# Altium project WAB_1x4.PrjPcb (part 1 of 2)
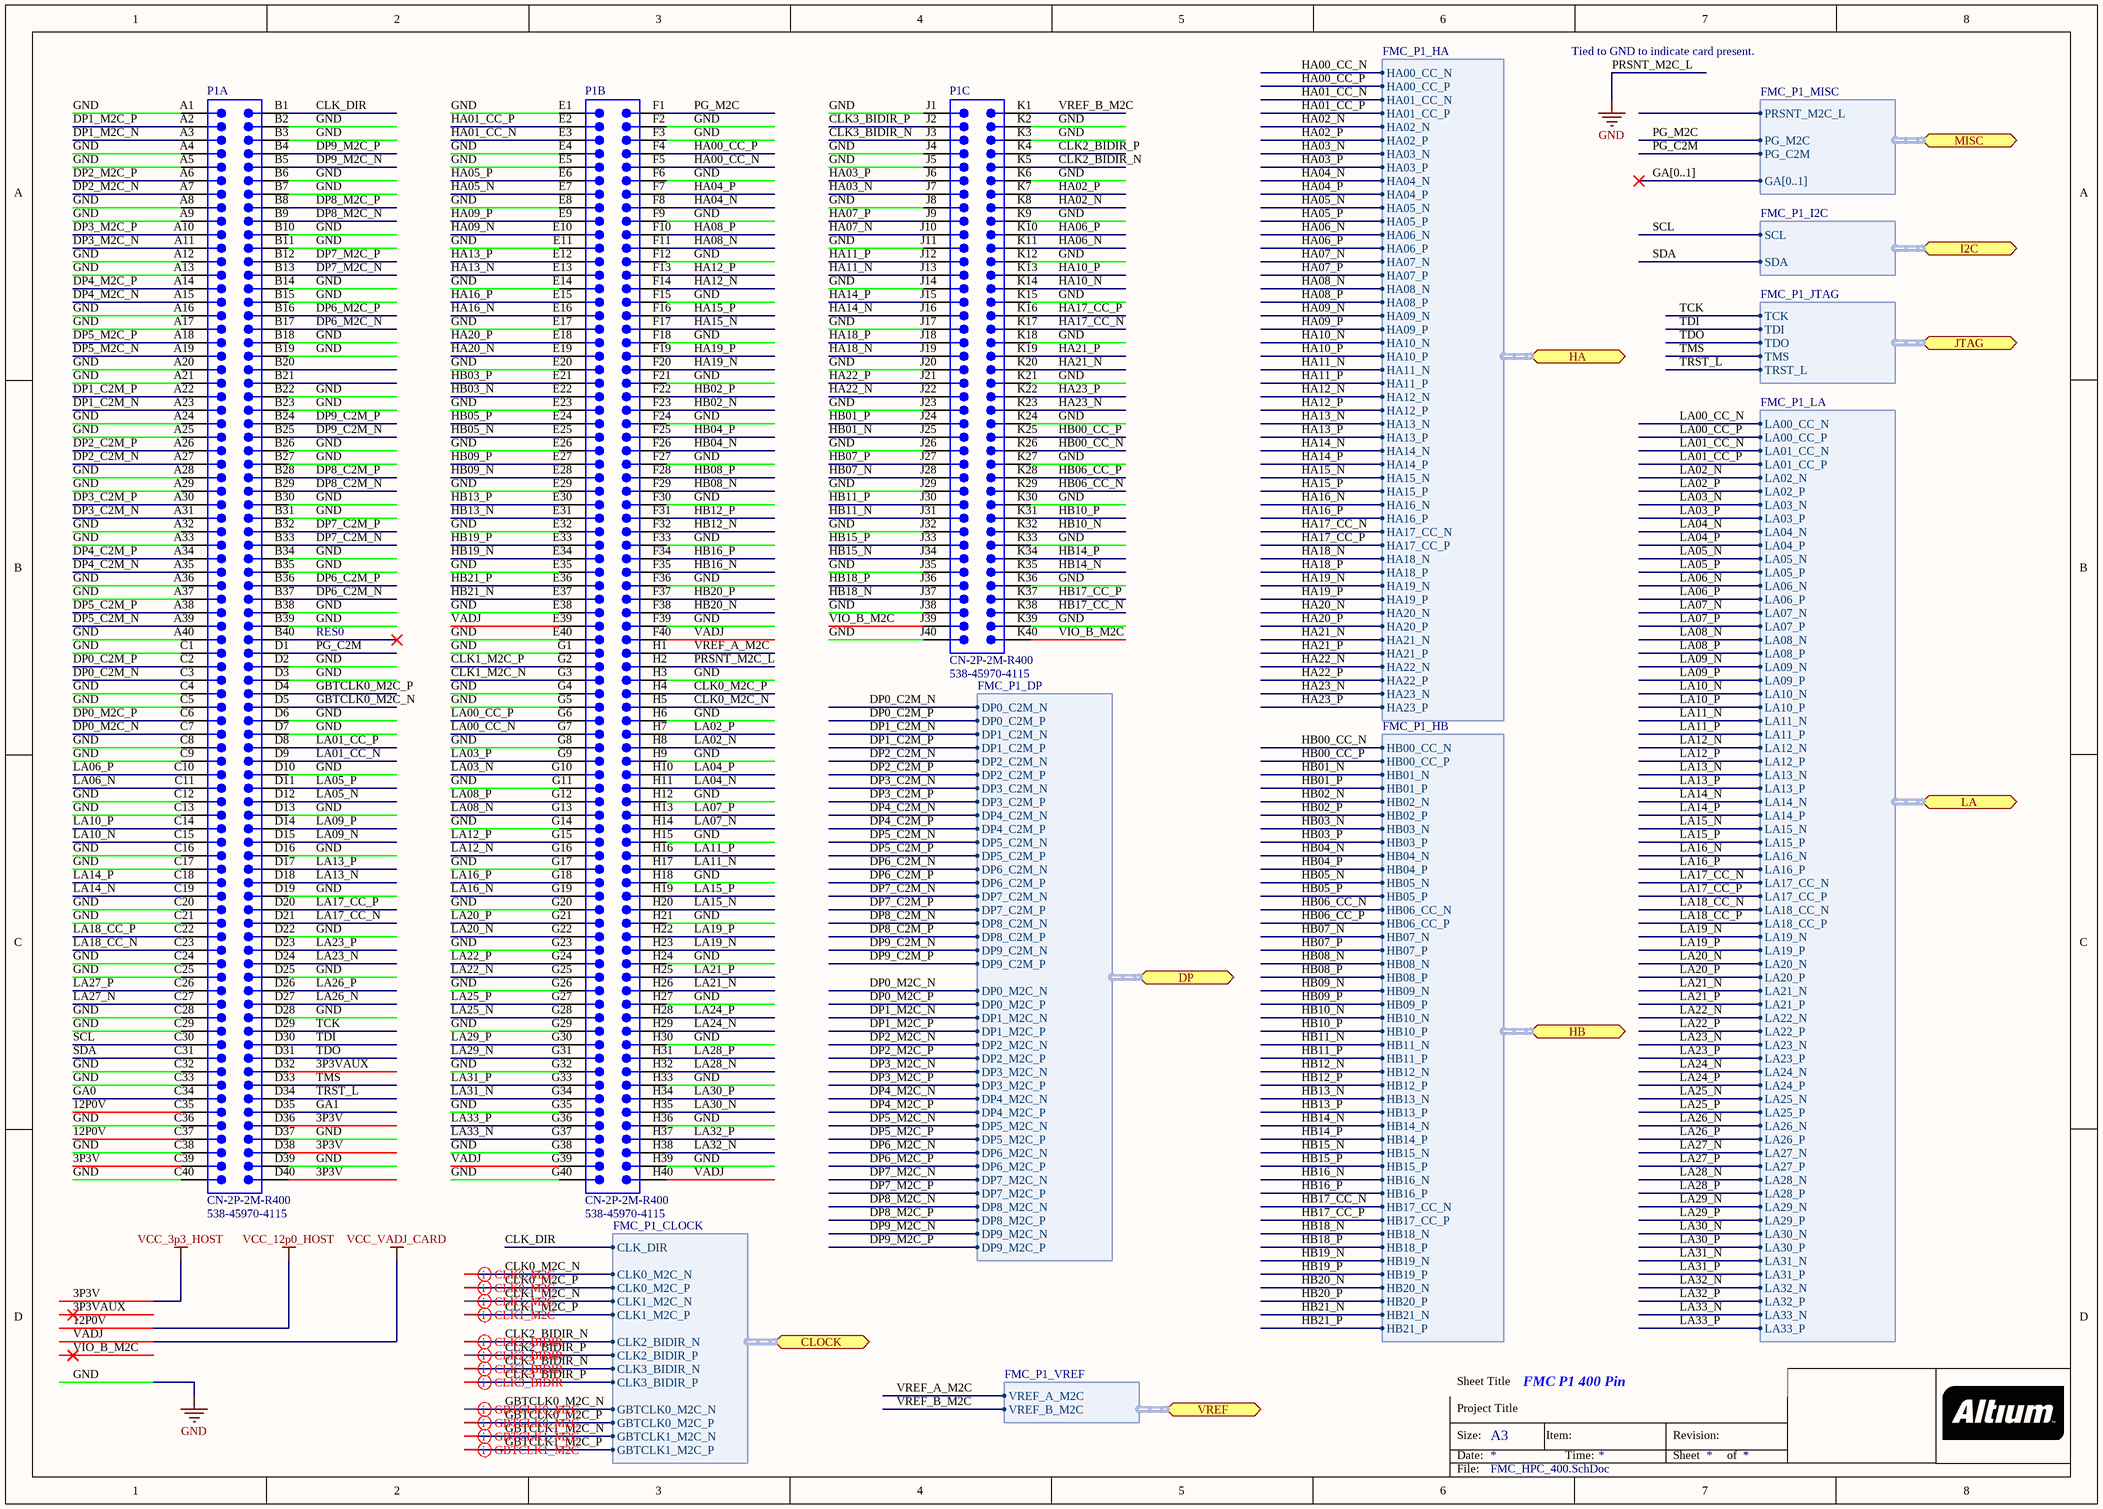
[diagram p0: FMC_HPC_400.SchDoc]
4 sheets, 113 parts. Net scope: flat (ports and power ports of the same name join across sheets).
Board file: WAB_1x4_PCB.PcbDoc
Sheets:
  FMC_HPC_400.SchDoc
  WAB_1x4_bus_transceivers.SchDoc
  WAB_1x4_HSMC_slots.SchDoc
  WAB_1x4_top.SchDoc

## Sheet FMC_HPC_400.SchDoc: FMC P1 400 Pin
size A3

### Parts
P1  CN-2P-2M-R400  Supplier Part Number 1: 538-45970-4115  [BTB-SM1-27-2V400M]  (parts A,B,C of 3)

### Ports
CLOCK (harness FMC_P1_CLOCK), DP (harness FMC_P1_DP), HA (harness FMC_P1_HA), HB (harness FMC_P1_HB), I2C (harness FMC_P1_I2C), JTAG (harness FMC_P1_JTAG), LA (harness FMC_P1_LA), MISC (harness FMC_P1_MISC), VREF (harness FMC_P1_VREF)

### Harnesses
FMC_P1_LA: LA05_N, LA05_P, LA06_N, LA06_P, LA09_N, LA09_P, LA10_N, LA10_P, LA13_N, LA13_P, LA14_N, LA14_P, LA23_N, LA23_P, LA26_N, LA26_P, LA27_N, LA27_P, LA02_N, LA02_P, LA03_N, LA03_P, LA04_N, LA04_P, LA07_N, LA07_P, LA08_N, LA08_P, LA11_N, LA11_P, LA12_N, LA12_P, LA15_N, LA15_P, LA16_N, LA16_P, LA19_N, LA19_P, LA20_N, LA20_P, LA21_N, LA21_P, LA22_N, LA22_P, LA24_N, LA24_P, LA25_N, LA25_P, LA28_N, LA28_P, LA29_N, LA29_P, LA30_N, LA30_P, LA31_N, LA31_P, LA32_N, LA32_P, LA33_N, LA33_P, LA00_CC_N, LA00_CC_P, LA01_CC_N, LA01_CC_P, LA17_CC_N, LA17_CC_P, LA18_CC_N, LA18_CC_P
FMC_P1_MISC: PRSNT_M2C_L, PG_M2C, PG_C2M, GA[0..1]
FMC_P1_JTAG: TCK, TDI, TDO, TMS, TRST_L
FMC_P1_I2C: SCL, SDA
FMC_P1_CLOCK: CLK2_BIDIR_N, CLK2_BIDIR_P, CLK3_BIDIR_N, CLK3_BIDIR_P, CLK0_M2C_N, CLK0_M2C_P, CLK1_M2C_N, CLK1_M2C_P, CLK_DIR, GBTCLK0_M2C_N, GBTCLK0_M2C_P, GBTCLK1_M2C_N, GBTCLK1_M2C_P
FMC_P1_VREF: VREF_A_M2C, VREF_B_M2C
FMC_P1_HB: HB02_N, HB02_P, HB03_N, HB03_P, HB04_N, HB04_P, HB05_N, HB05_P, HB08_N, HB08_P, HB09_N, HB09_P, HB12_N, HB12_P, HB13_N, HB13_P, HB16_N, HB16_P, HB19_N, HB19_P, HB20_N, HB20_P, HB21_N, HB21_P, HB01_N, HB01_P, HB07_N, HB07_P, HB10_N, HB10_P, HB11_N, HB11_P, HB14_N, HB14_P, HB15_N, HB15_P, HB18_N, HB18_P, HB17_CC_N, HB17_CC_P, HB06_CC_N, HB06_CC_P, HB00_CC_N, HB00_CC_P
FMC_P1_DP: DP1_C2M_N, DP1_C2M_P, DP1_M2C_N, DP1_M2C_P, DP2_C2M_N, DP2_C2M_P, DP2_M2C_N, DP2_M2C_P, DP3_C2M_N, DP3_C2M_P, DP3_M2C_N, DP3_M2C_P, DP4_C2M_N, DP4_C2M_P, DP4_M2C_N, DP4_M2C_P, DP5_C2M_N, DP5_C2M_P, DP5_M2C_N, DP5_M2C_P, DP6_C2M_N, DP6_C2M_P, DP6_M2C_N, DP6_M2C_P, DP7_C2M_N, DP7_C2M_P, DP7_M2C_N, DP7_M2C_P, DP8_C2M_N, DP8_C2M_P, DP8_M2C_N, DP8_M2C_P, DP9_C2M_N, DP9_C2M_P, DP9_M2C_N, DP9_M2C_P, DP0_C2M_N, DP0_C2M_P, DP0_M2C_N, DP0_M2C_P
FMC_P1_HA: HA04_N, HA04_P, HA05_N, HA05_P, HA08_N, HA08_P, HA09_N, HA09_P, HA12_N, HA12_P, HA13_N, HA13_P, HA15_N, HA15_P, HA16_N, HA16_P, HA19_N, HA19_P, HA20_N, HA20_P, HA02_N, HA02_P, HA03_N, HA03_P, HA06_N, HA06_P, HA07_N, HA07_P, HA10_N, HA10_P, HA11_N, HA11_P, HA14_N, HA14_P, HA18_N, HA18_P, HA21_N, HA21_P, HA22_N, HA22_P, HA23_N, HA23_P, HA17_CC_N, HA17_CC_P, HA00_CC_N, HA00_CC_P, HA01_CC_N, HA01_CC_P

### Nets
3P3V: P1.C39 P1.D36 P1.D38 P1.D40  [also labelled VCC_3p3_HOST]
12P0V: P1.C35 P1.C37  [also labelled VCC_12p0_HOST]
GND: P1.A1 P1.A4 P1.A5 P1.A8 P1.A9 P1.A12 P1.A13 P1.A16 P1.A17 P1.A20 P1.A21 P1.A24 P1.A25 P1.A28 P1.A29 P1.A32 P1.A33 P1.A36 P1.A37 P1.A40 P1.B2 P1.B3 P1.B6 P1.B7 P1.B10 P1.B11 P1.B14 P1.B15 P1.B18 P1.B19 P1.B22 P1.B23 P1.B26 P1.B27 P1.B30 P1.B31 P1.B34 P1.B35 P1.B38 P1.B39 P1.C1 P1.C4 P1.C5 P1.C8 P1.C9 P1.C12 P1.C13 P1.C16 P1.C17 P1.C20 P1.C21 P1.C24 P1.C25 P1.C28 P1.C29 P1.C32 P1.C33 P1.C36 P1.C38 P1.C40 P1.D2 P1.D3 P1.D6 P1.D7 P1.D10 P1.D13 P1.D16 P1.D19 P1.D22 P1.D25 P1.D28 P1.D37 P1.D39 P1.E1 P1.E4 P1.E5 P1.E8 P1.E11 P1.E14 P1.E17 P1.E20 P1.E23 P1.E26 P1.E29 P1.E32 P1.E35 P1.E38 P1.E40 P1.F2 P1.F3 P1.F6 P1.F9 P1.F12 P1.F15 P1.F18 P1.F21 P1.F24 P1.F27 P1.F30 P1.F33 P1.F36 P1.F39 P1.G1 P1.G4 P1.G5 P1.G8 P1.G11 P1.G14 P1.G17 P1.G20 P1.G23 P1.G26 P1.G29 P1.G32 P1.G35 P1.G38 P1.G40 P1.H2 P1.H3 P1.H6 P1.H9 P1.H12 P1.H15 P1.H18 P1.H21 P1.H24 P1.H27 P1.H30 P1.H33 P1.H36 P1.H39 P1.J1 P1.J4 P1.J5 P1.J8 P1.J11 P1.J14 P1.J17 P1.J20 P1.J23 P1.J26 P1.J29 P1.J32 P1.J35 P1.J38 P1.J40 P1.K2 P1.K3 P1.K6 P1.K9 P1.K12 P1.K15 P1.K18 P1.K21 P1.K24 P1.K27 P1.K30 P1.K33 P1.K36 P1.K39  [also labelled PRSNT_M2C_L]
VADJ: P1.E39 P1.F40 P1.G39 P1.H40  [also labelled VCC_VADJ_CARD]
3P3VAUX: P1.D32
CLK0_M2C_N: P1.H5 ; port CLOCK.CLK0_M2C_N
CLK0_M2C_P: P1.H4 ; port CLOCK.CLK0_M2C_P
CLK1_M2C_N: P1.G3 ; port CLOCK.CLK1_M2C_N
CLK1_M2C_P: P1.G2 ; port CLOCK.CLK1_M2C_P
CLK2_BIDIR_N: P1.K5 ; port CLOCK.CLK2_BIDIR_N
CLK2_BIDIR_P: P1.K4 ; port CLOCK.CLK2_BIDIR_P
CLK3_BIDIR_N: P1.J3 ; port CLOCK.CLK3_BIDIR_N
CLK3_BIDIR_P: P1.J2 ; port CLOCK.CLK3_BIDIR_P
CLK_DIR: P1.B1 ; port CLOCK.CLK_DIR
DP0_C2M_N: P1.C3 ; port DP.DP0_C2M_N
DP0_C2M_P: P1.C2 ; port DP.DP0_C2M_P
DP0_M2C_N: P1.C7 ; port DP.DP0_M2C_N
DP0_M2C_P: P1.C6 ; port DP.DP0_M2C_P
DP1_C2M_N: P1.A23 ; port DP.DP1_C2M_N
DP1_C2M_P: P1.A22 ; port DP.DP1_C2M_P
DP1_M2C_N: P1.A3 ; port DP.DP1_M2C_N
DP1_M2C_P: P1.A2 ; port DP.DP1_M2C_P
DP2_C2M_N: P1.A27 ; port DP.DP2_C2M_N
DP2_C2M_P: P1.A26 ; port DP.DP2_C2M_P
DP2_M2C_N: P1.A7 ; port DP.DP2_M2C_N
DP2_M2C_P: P1.A6 ; port DP.DP2_M2C_P
DP3_C2M_N: P1.A31 ; port DP.DP3_C2M_N
DP3_C2M_P: P1.A30 ; port DP.DP3_C2M_P
DP3_M2C_N: P1.A11 ; port DP.DP3_M2C_N
DP3_M2C_P: P1.A10 ; port DP.DP3_M2C_P
DP4_C2M_N: P1.A35 ; port DP.DP4_C2M_N
DP4_C2M_P: P1.A34 ; port DP.DP4_C2M_P
DP4_M2C_N: P1.A15 ; port DP.DP4_M2C_N
DP4_M2C_P: P1.A14 ; port DP.DP4_M2C_P
DP5_C2M_N: P1.A39 ; port DP.DP5_C2M_N
DP5_C2M_P: P1.A38 ; port DP.DP5_C2M_P
DP5_M2C_N: P1.A19 ; port DP.DP5_M2C_N
DP5_M2C_P: P1.A18 ; port DP.DP5_M2C_P
DP6_C2M_N: P1.B37 ; port DP.DP6_C2M_N
DP6_C2M_P: P1.B36 ; port DP.DP6_C2M_P
DP6_M2C_N: P1.B17 ; port DP.DP6_M2C_N
DP6_M2C_P: P1.B16 ; port DP.DP6_M2C_P
DP7_C2M_N: P1.B33 ; port DP.DP7_C2M_N
DP7_C2M_P: P1.B32 ; port DP.DP7_C2M_P
DP7_M2C_N: P1.B13 ; port DP.DP7_M2C_N
DP7_M2C_P: P1.B12 ; port DP.DP7_M2C_P
DP8_C2M_N: P1.B29 ; port DP.DP8_C2M_N
DP8_C2M_P: P1.B28 ; port DP.DP8_C2M_P
DP8_M2C_N: P1.B9 ; port DP.DP8_M2C_N
DP8_M2C_P: P1.B8 ; port DP.DP8_M2C_P
DP9_C2M_N: P1.B25 ; port DP.DP9_C2M_N
DP9_C2M_P: P1.B24 ; port DP.DP9_C2M_P
DP9_M2C_N: P1.B5 ; port DP.DP9_M2C_N
DP9_M2C_P: P1.B4 ; port DP.DP9_M2C_P
GA0: P1.C34
GA1: P1.D35
GBTCLK0_M2C_N: P1.D5 ; port CLOCK.GBTCLK0_M2C_N
GBTCLK0_M2C_P: P1.D4 ; port CLOCK.GBTCLK0_M2C_P
GBTCLK1_M2C_N: port CLOCK.GBTCLK1_M2C_N
GBTCLK1_M2C_P: port CLOCK.GBTCLK1_M2C_P
HA00_CC_N: P1.F5 ; port HA.HA00_CC_N
HA00_CC_P: P1.F4 ; port HA.HA00_CC_P
HA01_CC_N: P1.E3 ; port HA.HA01_CC_N
HA01_CC_P: P1.E2 ; port HA.HA01_CC_P
HA02_N: P1.K8 ; port HA.HA02_N
HA02_P: P1.K7 ; port HA.HA02_P
HA03_N: P1.J7 ; port HA.HA03_N
HA03_P: P1.J6 ; port HA.HA03_P
HA04_N: P1.F8 ; port HA.HA04_N
HA04_P: P1.F7 ; port HA.HA04_P
HA05_N: P1.E7 ; port HA.HA05_N
HA05_P: P1.E6 ; port HA.HA05_P
HA06_N: P1.K11 ; port HA.HA06_N
HA06_P: P1.K10 ; port HA.HA06_P
HA07_N: P1.J10 ; port HA.HA07_N
HA07_P: P1.J9 ; port HA.HA07_P
HA08_N: P1.F11 ; port HA.HA08_N
HA08_P: P1.F10 ; port HA.HA08_P
HA09_N: P1.E10 ; port HA.HA09_N
HA09_P: P1.E9 ; port HA.HA09_P
HA10_N: P1.K14 ; port HA.HA10_N
HA10_P: P1.K13 ; port HA.HA10_P
HA11_N: P1.J13 ; port HA.HA11_N
HA11_P: P1.J12 ; port HA.HA11_P
HA12_N: P1.F14 ; port HA.HA12_N
HA12_P: P1.F13 ; port HA.HA12_P
HA13_N: P1.E13 ; port HA.HA13_N
HA13_P: P1.E12 ; port HA.HA13_P
HA14_N: P1.J16 ; port HA.HA14_N
HA14_P: P1.J15 ; port HA.HA14_P
HA15_N: P1.F17 ; port HA.HA15_N
HA15_P: P1.F16 ; port HA.HA15_P
HA16_N: P1.E16 ; port HA.HA16_N
HA16_P: P1.E15 ; port HA.HA16_P
HA17_CC_N: P1.K17 ; port HA.HA17_CC_N
HA17_CC_P: P1.K16 ; port HA.HA17_CC_P
HA18_N: P1.J19 ; port HA.HA18_N
HA18_P: P1.J18 ; port HA.HA18_P
HA19_N: P1.F20 ; port HA.HA19_N
HA19_P: P1.F19 ; port HA.HA19_P
HA20_N: P1.E19 ; port HA.HA20_N
HA20_P: P1.E18 ; port HA.HA20_P
HA21_N: P1.K20 ; port HA.HA21_N
HA21_P: P1.K19 ; port HA.HA21_P
HA22_N: P1.J22 ; port HA.HA22_N
HA22_P: P1.J21 ; port HA.HA22_P
HA23_N: P1.K23 ; port HA.HA23_N
HA23_P: P1.K22 ; port HA.HA23_P
HB00_CC_N: P1.K26 ; port HB.HB00_CC_N
HB00_CC_P: P1.K25 ; port HB.HB00_CC_P
HB01_N: P1.J25 ; port HB.HB01_N
HB01_P: P1.J24 ; port HB.HB01_P
HB02_N: P1.F23 ; port HB.HB02_N
HB02_P: P1.F22 ; port HB.HB02_P
HB03_N: P1.E22 ; port HB.HB03_N
HB03_P: P1.E21 ; port HB.HB03_P
HB04_N: P1.F26 ; port HB.HB04_N
HB04_P: P1.F25 ; port HB.HB04_P
HB05_N: P1.E25 ; port HB.HB05_N
HB05_P: P1.E24 ; port HB.HB05_P
HB06_CC_N: P1.K29 ; port HB.HB06_CC_N
HB06_CC_P: P1.K28 ; port HB.HB06_CC_P
HB07_N: P1.J28 ; port HB.HB07_N
HB07_P: P1.J27 ; port HB.HB07_P
HB08_N: P1.F29 ; port HB.HB08_N
HB08_P: P1.F28 ; port HB.HB08_P
HB09_N: P1.E28 ; port HB.HB09_N
HB09_P: P1.E27 ; port HB.HB09_P
HB10_N: P1.K32 ; port HB.HB10_N
HB10_P: P1.K31 ; port HB.HB10_P
HB11_N: P1.J31 ; port HB.HB11_N
HB11_P: P1.J30 ; port HB.HB11_P
HB12_N: P1.F32 ; port HB.HB12_N
HB12_P: P1.F31 ; port HB.HB12_P
HB13_N: P1.E31 ; port HB.HB13_N
HB13_P: P1.E30 ; port HB.HB13_P
HB14_N: P1.K35 ; port HB.HB14_N
HB14_P: P1.K34 ; port HB.HB14_P
HB15_N: P1.J34 ; port HB.HB15_N
HB15_P: P1.J33 ; port HB.HB15_P
HB16_N: P1.F35 ; port HB.HB16_N
HB16_P: P1.F34 ; port HB.HB16_P
HB17_CC_N: P1.K38 ; port HB.HB17_CC_N
HB17_CC_P: P1.K37 ; port HB.HB17_CC_P
HB18_N: P1.J37 ; port HB.HB18_N
HB18_P: P1.J36 ; port HB.HB18_P
HB19_N: P1.E34 ; port HB.HB19_N
HB19_P: P1.E33 ; port HB.HB19_P
HB20_N: P1.F38 ; port HB.HB20_N
HB20_P: P1.F37 ; port HB.HB20_P
HB21_N: P1.E37 ; port HB.HB21_N
HB21_P: P1.E36 ; port HB.HB21_P
LA00_CC_N: P1.G7 ; port LA.LA00_CC_N
LA00_CC_P: P1.G6 ; port LA.LA00_CC_P
LA01_CC_N: P1.D9 ; port LA.LA01_CC_N
LA01_CC_P: P1.D8 ; port LA.LA01_CC_P
LA02_N: P1.H8 ; port LA.LA02_N
LA02_P: P1.H7 ; port LA.LA02_P
LA03_N: P1.G10 ; port LA.LA03_N
LA03_P: P1.G9 ; port LA.LA03_P
LA04_N: P1.H11 ; port LA.LA04_N
LA04_P: P1.H10 ; port LA.LA04_P
LA05_N: P1.D12 ; port LA.LA05_N
LA05_P: P1.D11 ; port LA.LA05_P
LA06_N: P1.C11 ; port LA.LA06_N
LA06_P: P1.C10 ; port LA.LA06_P
LA07_N: P1.H14 ; port LA.LA07_N
LA07_P: P1.H13 ; port LA.LA07_P
LA08_N: P1.G13 ; port LA.LA08_N
LA08_P: P1.G12 ; port LA.LA08_P
LA09_N: P1.D15 ; port LA.LA09_N
LA09_P: P1.D14 ; port LA.LA09_P
LA10_N: P1.C15 ; port LA.LA10_N
LA10_P: P1.C14 ; port LA.LA10_P
LA11_N: P1.H17 ; port LA.LA11_N
LA11_P: P1.H16 ; port LA.LA11_P
LA12_N: P1.G16 ; port LA.LA12_N
LA12_P: P1.G15 ; port LA.LA12_P
LA13_N: P1.D18 ; port LA.LA13_N
LA13_P: P1.D17 ; port LA.LA13_P
LA14_N: P1.C19 ; port LA.LA14_N
LA14_P: P1.C18 ; port LA.LA14_P
LA15_N: P1.H20 ; port LA.LA15_N
LA15_P: P1.H19 ; port LA.LA15_P
LA16_N: P1.G19 ; port LA.LA16_N
LA16_P: P1.G18 ; port LA.LA16_P
LA17_CC_N: P1.D21 ; port LA.LA17_CC_N
LA17_CC_P: P1.D20 ; port LA.LA17_CC_P
LA18_CC_N: P1.C23 ; port LA.LA18_CC_N
LA18_CC_P: P1.C22 ; port LA.LA18_CC_P
LA19_N: P1.H23 ; port LA.LA19_N
LA19_P: P1.H22 ; port LA.LA19_P
LA20_N: P1.G22 ; port LA.LA20_N
LA20_P: P1.G21 ; port LA.LA20_P
LA21_N: P1.H26 ; port LA.LA21_N
LA21_P: P1.H25 ; port LA.LA21_P
LA22_N: P1.G25 ; port LA.LA22_N
LA22_P: P1.G24 ; port LA.LA22_P
LA23_N: P1.D24 ; port LA.LA23_N
LA23_P: P1.D23 ; port LA.LA23_P
LA24_N: P1.H29 ; port LA.LA24_N
LA24_P: P1.H28 ; port LA.LA24_P
LA25_N: P1.G28 ; port LA.LA25_N
LA25_P: P1.G27 ; port LA.LA25_P
LA26_N: P1.D27 ; port LA.LA26_N
LA26_P: P1.D26 ; port LA.LA26_P
LA27_N: P1.C27 ; port LA.LA27_N
LA27_P: P1.C26 ; port LA.LA27_P
LA28_N: P1.H32 ; port LA.LA28_N
LA28_P: P1.H31 ; port LA.LA28_P
LA29_N: P1.G31 ; port LA.LA29_N
LA29_P: P1.G30 ; port LA.LA29_P
LA30_N: P1.H35 ; port LA.LA30_N
LA30_P: P1.H34 ; port LA.LA30_P
LA31_N: P1.G34 ; port LA.LA31_N
LA31_P: P1.G33 ; port LA.LA31_P
LA32_N: P1.H38 ; port LA.LA32_N
LA32_P: P1.H37 ; port LA.LA32_P
LA33_N: P1.G37 ; port LA.LA33_N
LA33_P: P1.G36 ; port LA.LA33_P
PG_C2M: P1.D1 ; port MISC.PG_C2M
PG_M2C: P1.F1 ; port MISC.PG_M2C
SCL: P1.C30 ; port I2C.SCL
SDA: P1.C31 ; port I2C.SDA
TCK: P1.D29 ; port JTAG.TCK  [project net JTAG_TCK]
TDI: P1.D30 ; port JTAG.TDI  [project net JTAG_TDI]
TDO: P1.D31 ; port JTAG.TDO  [project net JTAG_TDO]
TMS: P1.D33 ; port JTAG.TMS  [project net JTAG_TMS]
TRST_L: P1.D34 ; port JTAG.TRST_L  [project net ~{uC_RESET}]
VIO_B_M2C: P1.J39 P1.K40
VREF_A_M2C: P1.H1 ; port VREF.VREF_A_M2C
VREF_B_M2C: P1.K1 ; port VREF.VREF_B_M2C

Not connected (* = marked no-connect by the designer): P1 B20 B21 B40*

### Buses and harness runs
bus GA[0..1]

### Layout directives
differential pair: CLK0_M2C_N, CLK0_M2C_P, CLK1_M2C_N, CLK1_M2C_P, CLK2_BIDIR_N, CLK2_BIDIR_P, CLK3_BIDIR_N, CLK3_BIDIR_P, GBTCLK0_M2C_N, GBTCLK0_M2C_P, GBTCLK1_M2C_N, GBTCLK1_M2C_P

### Notes on the sheet
- Tied to GND to indicate card present.
- RES0
- Sheet Title
- Project Title
- Size:
- Date:
- A3
- Item:
- Time:
- Revision:
- Sheet
- of
- File:

### Library data of the parts
P1 = CN-2P-2M-R400: Board-to-Board Connector, Vertical, 10-Row, Pitch 1.27mm, 400-Position; Manufacturer: Molex; Manufacturer Part Number: 45970-4115; Current Rating: 2.7 A; Voltage Rating: 240 V; Number of Positions / Contacts: 400; Supplier 1: Mouser; RoHS: RoHS Compliant; Category: Board to Board & Mezzanine Connectors; Stock 1: 161; Pricing 1: 1=36.56, 10=32.14, 100=28.08, 300=26.87 (USD); Contact Plating: Gold; Housing Material: Thermoplastic; Mounting Angle: Vertical; Number of Rows: 10; Packaging: Reel; Series: 45970; Termination Style: SMD; Brand: Molex; Contact Material: Copper Alloy; Pitch: 1.27 mm; Product Category: Mezzanine Connectors; Product Type: Plugs; Standard Pack Qty: 300; Tradename: SEARAY; RoHS - Mouser: Y; Minimum Order Quantity: 1; Reeling: True; ComponentLink1URL: http://www.mouser.com/ds/2/276/0459704115_PCB_HEADERS-169229.pdf; ComponentLink1Description: http://www.mouser.com/ds/2/276/0459704115_PCB_HEADERS-169229.pdf

## Sheet WAB_1x4_bus_transceivers.SchDoc
size A2
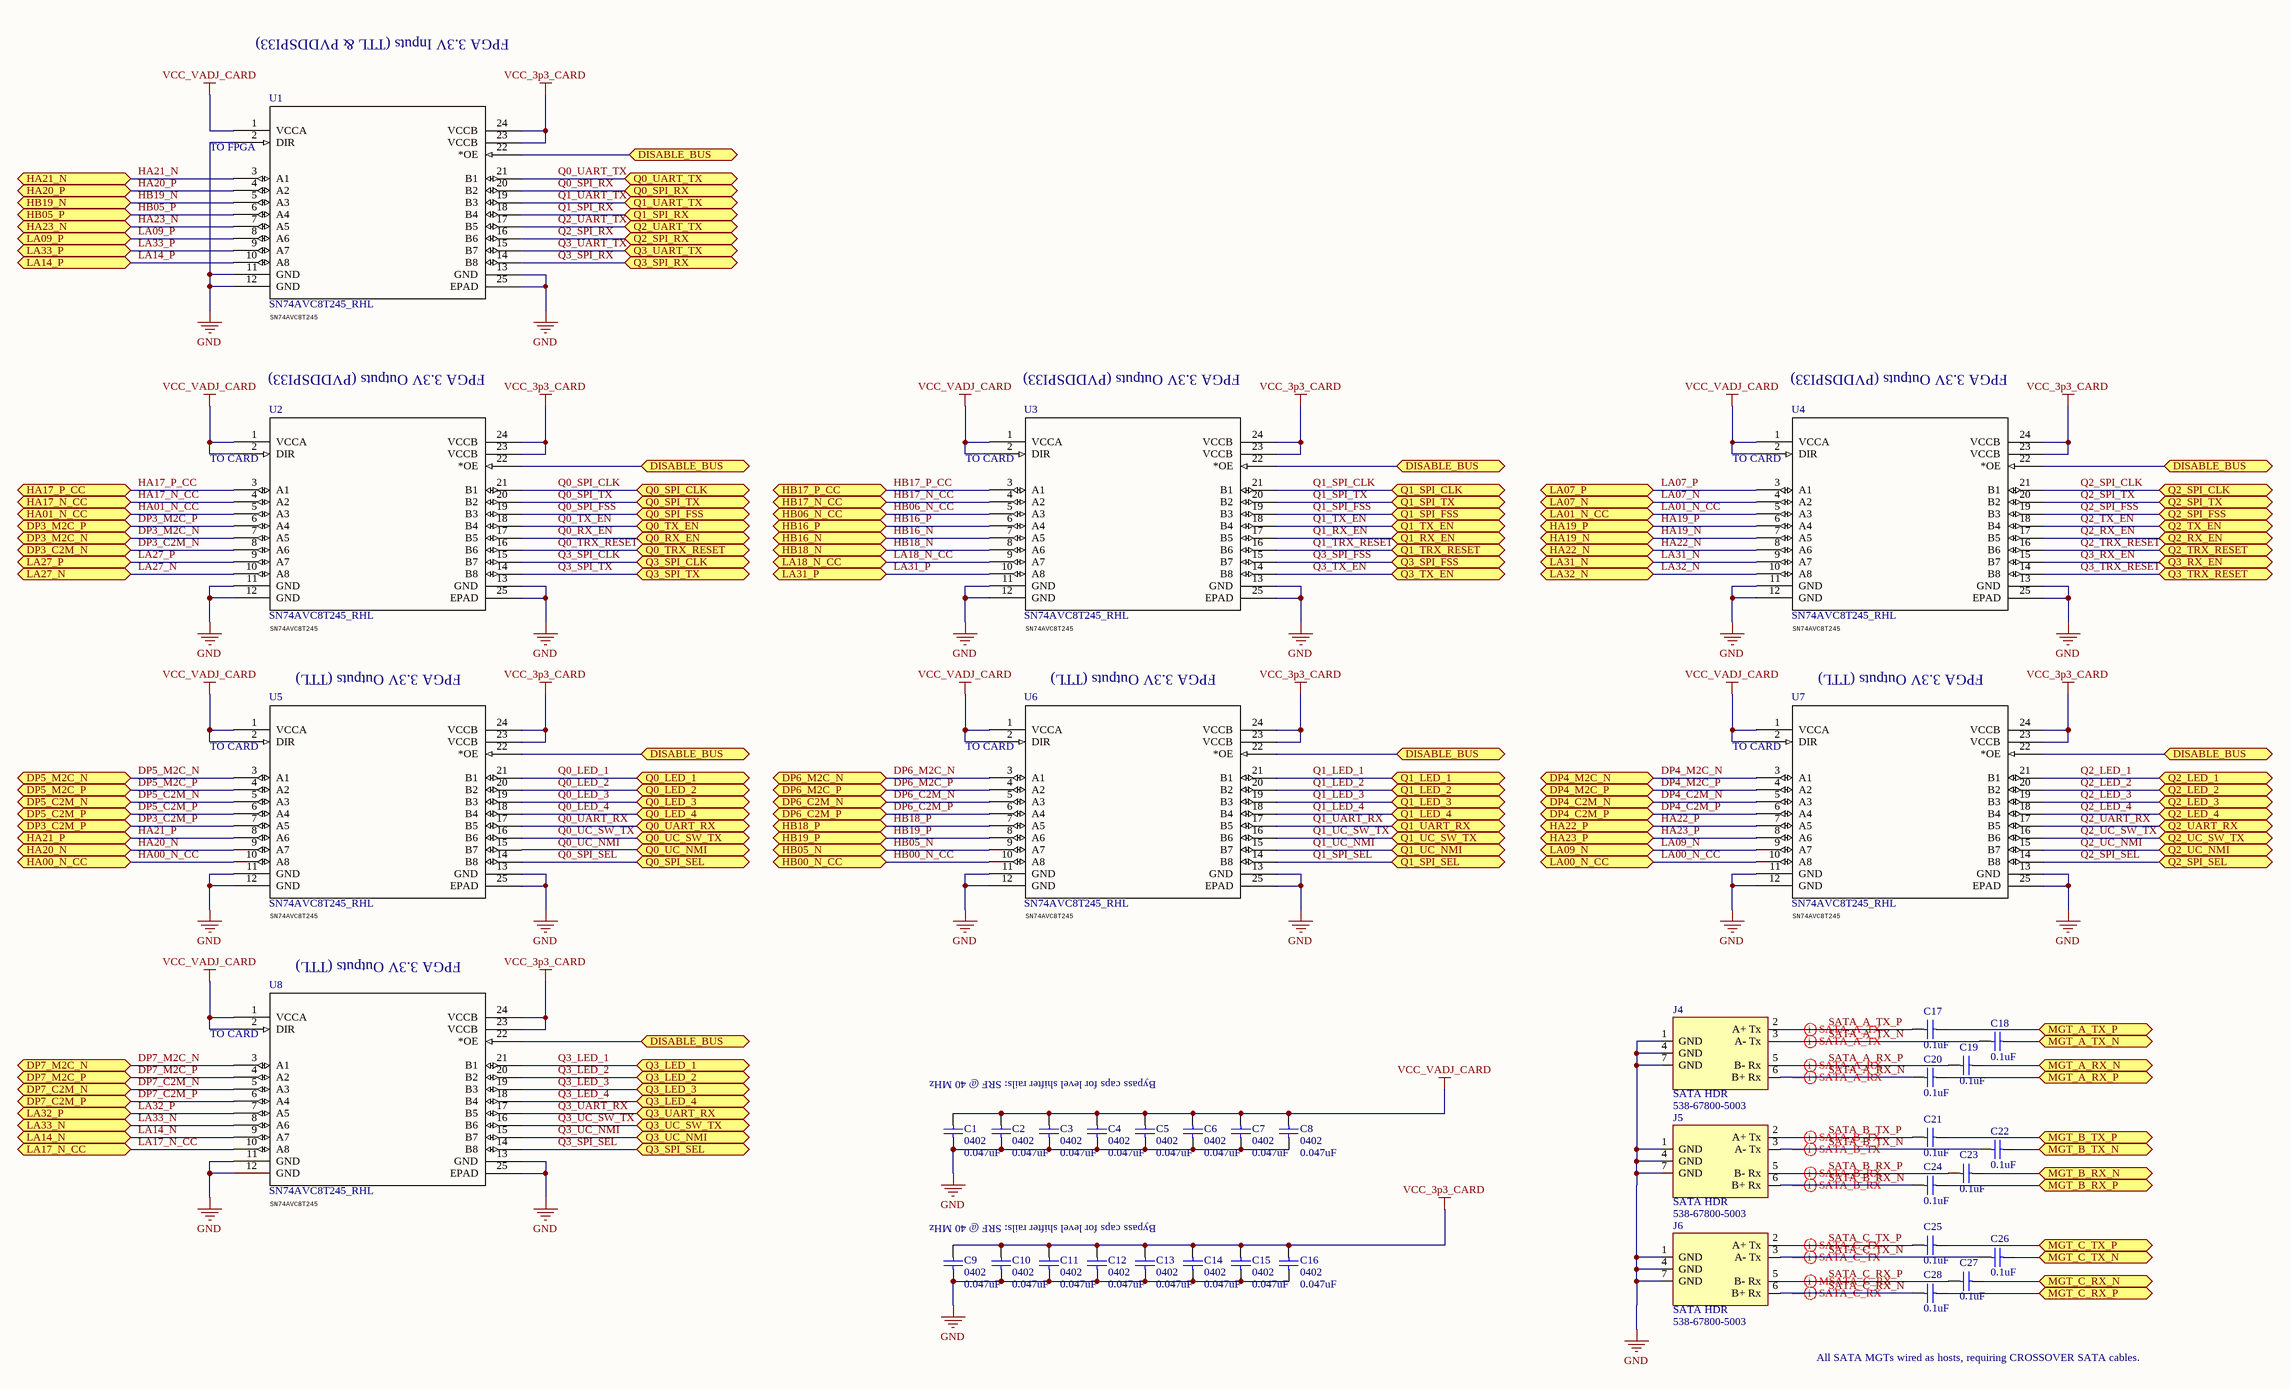
[diagram p1: WAB_1x4_bus_transceivers.SchDoc]

### Parts
C1  0402  value 0.047uF  [0402_SMT_CAP]
C2  0402  value 0.047uF  [0402_SMT_CAP]
C3  0402  value 0.047uF  [0402_SMT_CAP]
C4  0402  value 0.047uF  [0402_SMT_CAP]
C5  0402  value 0.047uF  [0402_SMT_CAP]
C6  0402  value 0.047uF  [0402_SMT_CAP]
C7  0402  value 0.047uF  [0402_SMT_CAP]
C8  0402  value 0.047uF  [0402_SMT_CAP]
C9  0402  value 0.047uF  [0402_SMT_CAP]
C10  0402  value 0.047uF  [0402_SMT_CAP]
C11  0402  value 0.047uF  [0402_SMT_CAP]
C12  0402  value 0.047uF  [0402_SMT_CAP]
C13  0402  value 0.047uF  [0402_SMT_CAP]
C14  0402  value 0.047uF  [0402_SMT_CAP]
C15  0402  value 0.047uF  [0402_SMT_CAP]
C16  0402  value 0.047uF  [0402_SMT_CAP]
C17  value 0.1uF  [0402_SMT_CAP]  (hidden comment: 0402)
C18  value 0.1uF  [0402_SMT_CAP]  (hidden comment: 0402)
C19  value 0.1uF  [0402_SMT_CAP]  (hidden comment: 0402)
C20  value 0.1uF  [0402_SMT_CAP]  (hidden comment: 0402)
C21  value 0.1uF  [0402_SMT_CAP]  (hidden comment: 0402)
C22  value 0.1uF  [0402_SMT_CAP]  (hidden comment: 0402)
C23  value 0.1uF  [0402_SMT_CAP]  (hidden comment: 0402)
C24  value 0.1uF  [0402_SMT_CAP]  (hidden comment: 0402)
C25  value 0.1uF  [0402_SMT_CAP]  (hidden comment: 0402)
C26  value 0.1uF  [0402_SMT_CAP]  (hidden comment: 0402)
C27  value 0.1uF  [0402_SMT_CAP]  (hidden comment: 0402)
C28  value 0.1uF  [0402_SMT_CAP]  (hidden comment: 0402)
J4  SATA HDR  Supplier Part Number 1: 538-67800-5003  [Molex_67800-5003_V2]
J5  SATA HDR  Supplier Part Number 1: 538-67800-5003  [Molex_67800-5003_V2]
J6  SATA HDR  Supplier Part Number 1: 538-67800-5003  [Molex_67800-5003_V2]
U1  SN74AVC8T245_RHL  GENERIC_PART_NUMBER: SN74AVC8T245  [RHL24_4P05X2P05_V3]
U2  SN74AVC8T245_RHL  GENERIC_PART_NUMBER: SN74AVC8T245  [RHL24_4P05X2P05_V3]
U3  SN74AVC8T245_RHL  GENERIC_PART_NUMBER: SN74AVC8T245  [RHL24_4P05X2P05_V3]
U4  SN74AVC8T245_RHL  GENERIC_PART_NUMBER: SN74AVC8T245  [RHL24_4P05X2P05_V3]
U5  SN74AVC8T245_RHL  GENERIC_PART_NUMBER: SN74AVC8T245  [RHL24_4P05X2P05_V3]
U6  SN74AVC8T245_RHL  GENERIC_PART_NUMBER: SN74AVC8T245  [RHL24_4P05X2P05_V3]
U7  SN74AVC8T245_RHL  GENERIC_PART_NUMBER: SN74AVC8T245  [RHL24_4P05X2P05_V3]
U8  SN74AVC8T245_RHL  GENERIC_PART_NUMBER: SN74AVC8T245  [RHL24_4P05X2P05_V3]

### Ports
DISABLE_BUS (bidir), DP3_C2M_N (bidir), DP3_C2M_P (bidir), DP3_M2C_N (bidir), DP3_M2C_P (bidir), DP4_C2M_N (bidir), DP4_C2M_P (bidir), DP4_M2C_N (bidir), DP4_M2C_P (bidir), DP5_C2M_N (bidir), DP5_C2M_P (bidir), DP5_M2C_N (bidir), DP5_M2C_P (bidir), DP6_C2M_N (bidir), DP6_C2M_P (bidir), DP6_M2C_N (bidir), DP6_M2C_P (bidir), DP7_C2M_N (bidir), DP7_C2M_P (bidir), DP7_M2C_N (bidir), DP7_M2C_P (bidir), HA00_N_CC (bidir), HA01_N_CC (bidir), HA17_N_CC (bidir), HA17_P_CC (bidir), HA19_N (bidir), HA19_P (bidir), HA20_N (bidir), HA20_P (bidir), HA21_N (bidir), HA21_P (bidir), HA22_N (bidir), HA22_P (bidir), HA23_N (bidir), HA23_P (bidir), HB00_N_CC (bidir), HB05_N (bidir), HB05_P (bidir), HB06_N_CC (bidir), HB16_N (bidir), HB16_P (bidir), HB17_N_CC (bidir), HB17_P_CC (bidir), HB18_N (bidir), HB18_P (bidir), HB19_N (bidir), HB19_P (bidir), LA00_N_CC (bidir), LA01_N_CC (bidir), LA07_N (bidir), LA07_P (bidir), LA09_N (bidir), LA09_P (bidir), LA14_N (bidir), LA14_P (bidir), LA17_N_CC (bidir), LA18_N_CC (bidir), LA27_N (bidir), LA27_P (bidir), LA31_N (bidir), LA31_P (bidir), LA32_N (bidir), LA32_P (bidir), LA33_N (bidir), LA33_P (bidir), MGT_A_RX_N (bidir), MGT_A_RX_P (bidir), MGT_A_TX_N (bidir), MGT_A_TX_P (bidir), MGT_B_RX_N (bidir), MGT_B_RX_P (bidir), MGT_B_TX_N (bidir), MGT_B_TX_P (bidir), MGT_C_RX_N (bidir), MGT_C_RX_P (bidir), MGT_C_TX_N (bidir), MGT_C_TX_P (bidir), Q0_LED_1 (bidir), Q0_LED_2 (bidir), Q0_LED_3 (bidir), Q0_LED_4 (bidir), Q0_RX_EN (bidir), Q0_SPI_CLK (bidir), Q0_SPI_FSS (bidir), Q0_SPI_RX (bidir), Q0_SPI_SEL (bidir), Q0_SPI_TX (bidir), Q0_TRX_RESET (bidir), Q0_TX_EN (bidir), Q0_UART_RX (bidir), Q0_UART_TX (bidir), Q0_UC_NMI (bidir), Q0_UC_SW_TX (bidir), Q1_LED_1 (bidir), Q1_LED_2 (bidir), Q1_LED_3 (bidir), Q1_LED_4 (bidir), Q1_RX_EN (bidir), Q1_SPI_CLK (bidir), Q1_SPI_FSS (bidir), Q1_SPI_RX (bidir), Q1_SPI_SEL (bidir), Q1_SPI_TX (bidir), Q1_TRX_RESET (bidir), Q1_TX_EN (bidir), Q1_UART_RX (bidir), Q1_UART_TX (bidir), Q1_UC_NMI (bidir), Q1_UC_SW_TX (bidir), Q2_LED_1 (bidir), Q2_LED_2 (bidir), Q2_LED_3 (bidir), Q2_LED_4 (bidir), Q2_RX_EN (bidir), Q2_SPI_CLK (bidir), Q2_SPI_FSS (bidir), Q2_SPI_RX (bidir), Q2_SPI_SEL (bidir), Q2_SPI_TX (bidir), Q2_TRX_RESET (bidir), Q2_TX_EN (bidir), Q2_UART_RX (bidir), Q2_UART_TX (bidir), Q2_UC_NMI (bidir), Q2_UC_SW_TX (bidir), Q3_LED_1 (bidir), Q3_LED_2 (bidir), Q3_LED_3 (bidir), Q3_LED_4 (bidir), Q3_RX_EN (bidir), Q3_SPI_CLK (bidir), Q3_SPI_FSS (bidir), Q3_SPI_RX (bidir), Q3_SPI_SEL (bidir), Q3_SPI_TX (bidir), Q3_TRX_RESET (bidir), Q3_TX_EN (bidir), Q3_UART_RX (bidir), Q3_UART_TX (bidir), Q3_UC_NMI (bidir), Q3_UC_SW_TX (bidir)

### Nets
GND: C1.2 C2.2 C3.2 C4.2 C5.2 C6.2 C7.2 C8.2 C9.2 C10.2 C11.2 C12.2 C13.2 C14.2 C15.2 C16.2 J4.1(GND) J4.4(GND) J4.7(GND) J5.1(GND) J5.4(GND) J5.7(GND) J6.1(GND) J6.4(GND) J6.7(GND) U1.2(DIR) U1.11(GND) U1.12(GND) U1.13(GND) U1.25(EPAD) U2.11(GND) U2.12(GND) U2.13(GND) U2.25(EPAD) U3.11(GND) U3.12(GND) U3.13(GND) U3.25(EPAD) U4.11(GND) U4.12(GND) U4.13(GND) U4.25(EPAD) U5.11(GND) U5.12(GND) U5.13(GND) U5.25(EPAD) U6.11(GND) U6.12(GND) U6.13(GND) U6.25(EPAD) U7.11(GND) U7.12(GND) U7.13(GND) U7.25(EPAD) U8.11(GND) U8.12(GND) U8.13(GND) U8.25(EPAD)
VCC_3p3_CARD: C9.1 C10.1 C11.1 C12.1 C13.1 C14.1 C15.1 C16.1 U1.23(VCCB) U1.24(VCCB) U2.23(VCCB) U2.24(VCCB) U3.23(VCCB) U3.24(VCCB) U4.23(VCCB) U4.24(VCCB) U5.23(VCCB) U5.24(VCCB) U6.23(VCCB) U6.24(VCCB) U7.23(VCCB) U7.24(VCCB) U8.23(VCCB) U8.24(VCCB)
VCC_VADJ_CARD: C1.1 C2.1 C3.1 C4.1 C5.1 C6.1 C7.1 C8.1 U1.1(VCCA) U2.1(VCCA) U2.2(DIR) U3.1(VCCA) U3.2(DIR) U4.1(VCCA) U4.2(DIR) U5.1(VCCA) U5.2(DIR) U6.1(VCCA) U6.2(DIR) U7.1(VCCA) U7.2(DIR) U8.1(VCCA) U8.2(DIR)  [project net VADJ]
DP0_C2M_N: C18.2 ; port MGT_A_TX_N
DP0_C2M_P: C17.2 ; port MGT_A_TX_P
DP0_M2C_N: C19.2 ; port MGT_A_RX_N
DP0_M2C_P: C20.2 ; port MGT_A_RX_P
DP1_C2M_N: C22.2 ; port MGT_B_TX_N
DP1_C2M_P: C21.2 ; port MGT_B_TX_P
DP1_M2C_N: C23.2 ; port MGT_B_RX_N
DP1_M2C_P: C24.2 ; port MGT_B_RX_P
DP2_C2M_N: C26.2 ; port MGT_C_TX_N
DP2_C2M_P: C25.2 ; port MGT_C_TX_P
DP2_M2C_N: C27.2 ; port MGT_C_RX_N
DP2_M2C_P: C28.2 ; port MGT_C_RX_P
DP3_C2M_N: U2.8(A6) ; port DP3_C2M_N
DP3_C2M_P: U5.7(A5) ; port DP3_C2M_P
DP3_M2C_N: U2.7(A5) ; port DP3_M2C_N
DP3_M2C_P: U2.6(A4) ; port DP3_M2C_P
DP4_C2M_N: U7.5(A3) ; port DP4_C2M_N
DP4_C2M_P: U7.6(A4) ; port DP4_C2M_P
DP4_M2C_N: U7.3(A1) ; port DP4_M2C_N
DP4_M2C_P: U7.4(A2) ; port DP4_M2C_P
DP5_C2M_N: U5.5(A3) ; port DP5_C2M_N
DP5_C2M_P: U5.6(A4) ; port DP5_C2M_P
DP5_M2C_N: U5.3(A1) ; port DP5_M2C_N
DP5_M2C_P: U5.4(A2) ; port DP5_M2C_P
DP6_C2M_N: U6.5(A3) ; port DP6_C2M_N
DP6_C2M_P: U6.6(A4) ; port DP6_C2M_P
DP6_M2C_N: U6.3(A1) ; port DP6_M2C_N
DP6_M2C_P: U6.4(A2) ; port DP6_M2C_P
DP7_C2M_N: U8.5(A3) ; port DP7_C2M_N
DP7_C2M_P: U8.6(A4) ; port DP7_C2M_P
DP7_M2C_N: U8.3(A1) ; port DP7_M2C_N
DP7_M2C_P: U8.4(A2) ; port DP7_M2C_P
HA00_N_CC: U5.10(A8) ; port HA00_N_CC  [project net HA00_CC_N]
HA01_N_CC: U2.5(A3) ; port HA01_N_CC  [project net HA01_CC_N]
HA17_N_CC: U2.4(A2) ; port HA17_N_CC  [project net HA17_CC_N]
HA17_P_CC: U2.3(A1) ; port HA17_P_CC  [project net HA17_CC_P]
HA19_N: U4.7(A5) ; port HA19_N
HA19_P: U4.6(A4) ; port HA19_P
HA20_N: U5.9(A7) ; port HA20_N
HA20_P: U1.4(A2) ; port HA20_P
HA21_N: U1.3(A1) ; port HA21_N
HA21_P: U5.8(A6) ; port HA21_P
HA22_N: U4.8(A6) ; port HA22_N
HA22_P: U7.7(A5) ; port HA22_P
HA23_N: U1.7(A5) ; port HA23_N
HA23_P: U7.8(A6) ; port HA23_P
HB00_N_CC: U6.10(A8) ; port HB00_N_CC  [project net HB00_CC_N]
HB05_N: U6.9(A7) ; port HB05_N
HB05_P: U1.6(A4) ; port HB05_P
HB06_N_CC: U3.5(A3) ; port HB06_N_CC  [project net HB06_CC_N]
HB16_N: U3.7(A5) ; port HB16_N
HB16_P: U3.6(A4) ; port HB16_P
HB17_N_CC: U3.4(A2) ; port HB17_N_CC  [project net HB17_CC_N]
HB17_P_CC: U3.3(A1) ; port HB17_P_CC  [project net HB17_CC_P]
HB18_N: U3.8(A6) ; port HB18_N
HB18_P: U6.7(A5) ; port HB18_P
HB19_N: U1.5(A3) ; port HB19_N
HB19_P: U6.8(A6) ; port HB19_P
LA00_N_CC: U7.10(A8) ; port LA00_N_CC  [project net LA00_CC_N]
LA01_N_CC: U4.5(A3) ; port LA01_N_CC  [project net LA01_CC_N]
LA07_N: U4.4(A2) ; port LA07_N
LA07_P: U4.3(A1) ; port LA07_P
LA09_N: U7.9(A7) ; port LA09_N
LA09_P: U1.8(A6) ; port LA09_P
LA14_N: U8.9(A7) ; port LA14_N
LA14_P: U1.10(A8) ; port LA14_P
LA17_N_CC: U8.10(A8) ; port LA17_N_CC  [project net LA17_CC_N]
LA18_N_CC: U3.9(A7) ; port LA18_N_CC  [project net LA18_CC_N]
LA27_N: U2.10(A8) ; port LA27_N
LA27_P: U2.9(A7) ; port LA27_P
LA31_N: U4.9(A7) ; port LA31_N
LA31_P: U3.10(A8) ; port LA31_P
LA32_N: U4.10(A8) ; port LA32_N
LA32_P: U8.7(A5) ; port LA32_P
LA33_N: U8.8(A6) ; port LA33_N
LA33_P: U1.9(A7) ; port LA33_P
Q0_LED_1: U5.21(B1) ; port Q0_LED_1
Q0_LED_2: U5.20(B2) ; port Q0_LED_2
Q0_LED_3: U5.19(B3) ; port Q0_LED_3
Q0_LED_4: U5.18(B4) ; port Q0_LED_4
Q0_RX_EN: U2.17(B5) ; port Q0_RX_EN
Q0_SPI_CLK: U2.21(B1) ; port Q0_SPI_CLK
Q0_SPI_FSS: U2.19(B3) ; port Q0_SPI_FSS
Q0_SPI_RX: U1.20(B2) ; port Q0_SPI_RX
Q0_SPI_SEL: U5.14(B8) ; port Q0_SPI_SEL
Q0_SPI_TX: U2.20(B2) ; port Q0_SPI_TX
Q0_TRX_RESET: U2.16(B6) ; port Q0_TRX_RESET
Q0_TX_EN: U2.18(B4) ; port Q0_TX_EN
Q0_UART_RX: U5.17(B5) ; port Q0_UART_RX
Q0_UART_TX: U1.21(B1) ; port Q0_UART_TX
Q0_UC_NMI: U5.15(B7) ; port Q0_UC_NMI
Q0_UC_SW_TX: U5.16(B6) ; port Q0_UC_SW_TX
Q1_LED_1: U6.21(B1) ; port Q1_LED_1
Q1_LED_2: U6.20(B2) ; port Q1_LED_2
Q1_LED_3: U6.19(B3) ; port Q1_LED_3
Q1_LED_4: U6.18(B4) ; port Q1_LED_4
Q1_RX_EN: U3.17(B5) ; port Q1_RX_EN
Q1_SPI_CLK: U3.21(B1) ; port Q1_SPI_CLK
Q1_SPI_FSS: U3.19(B3) ; port Q1_SPI_FSS
Q1_SPI_RX: U1.18(B4) ; port Q1_SPI_RX
Q1_SPI_SEL: U6.14(B8) ; port Q1_SPI_SEL
Q1_SPI_TX: U3.20(B2) ; port Q1_SPI_TX
Q1_TRX_RESET: U3.16(B6) ; port Q1_TRX_RESET
Q1_TX_EN: U3.18(B4) ; port Q1_TX_EN
Q1_UART_RX: U6.17(B5) ; port Q1_UART_RX
Q1_UART_TX: U1.19(B3) ; port Q1_UART_TX
Q1_UC_NMI: U6.15(B7) ; port Q1_UC_NMI
Q1_UC_SW_TX: U6.16(B6) ; port Q1_UC_SW_TX
Q2_LED_1: U7.21(B1) ; port Q2_LED_1
Q2_LED_2: U7.20(B2) ; port Q2_LED_2
Q2_LED_3: U7.19(B3) ; port Q2_LED_3
Q2_LED_4: U7.18(B4) ; port Q2_LED_4
Q2_RX_EN: U4.17(B5) ; port Q2_RX_EN
Q2_SPI_CLK: U4.21(B1) ; port Q2_SPI_CLK
Q2_SPI_FSS: U4.19(B3) ; port Q2_SPI_FSS
Q2_SPI_RX: U1.16(B6) ; port Q2_SPI_RX
Q2_SPI_SEL: U7.14(B8) ; port Q2_SPI_SEL
Q2_SPI_TX: U4.20(B2) ; port Q2_SPI_TX
Q2_TRX_RESET: U4.16(B6) ; port Q2_TRX_RESET
Q2_TX_EN: U4.18(B4) ; port Q2_TX_EN
Q2_UART_RX: U7.17(B5) ; port Q2_UART_RX
Q2_UART_TX: U1.17(B5) ; port Q2_UART_TX
Q2_UC_NMI: U7.15(B7) ; port Q2_UC_NMI
Q2_UC_SW_TX: U7.16(B6) ; port Q2_UC_SW_TX
Q3_LED_1: U8.21(B1) ; port Q3_LED_1
Q3_LED_2: U8.20(B2) ; port Q3_LED_2
Q3_LED_3: U8.19(B3) ; port Q3_LED_3
Q3_LED_4: U8.18(B4) ; port Q3_LED_4
Q3_RX_EN: U4.15(B7) ; port Q3_RX_EN
Q3_SPI_CLK: U2.15(B7) ; port Q3_SPI_CLK
Q3_SPI_FSS: U3.15(B7) ; port Q3_SPI_FSS
Q3_SPI_RX: U1.14(B8) ; port Q3_SPI_RX
Q3_SPI_SEL: U8.14(B8) ; port Q3_SPI_SEL
Q3_SPI_TX: U2.14(B8) ; port Q3_SPI_TX
Q3_TRX_RESET: U4.14(B8) ; port Q3_TRX_RESET
Q3_TX_EN: U3.14(B8) ; port Q3_TX_EN
Q3_UART_RX: U8.17(B5) ; port Q3_UART_RX
Q3_UART_TX: U1.15(B7) ; port Q3_UART_TX
Q3_UC_NMI: U8.15(B7) ; port Q3_UC_NMI
Q3_UC_SW_TX: U8.16(B6) ; port Q3_UC_SW_TX
SATA_A_RX_N: C20.1 J4.6(B+_Rx)
SATA_A_RX_P: C19.1 J4.5(B-_Rx)
SATA_A_TX_N: C18.1 J4.3(A-_Tx)
SATA_A_TX_P: C17.1 J4.2(A+_Tx)
SATA_B_RX_N: C24.1 J5.6(B+_Rx)
SATA_B_RX_P: C23.1 J5.5(B-_Rx)
SATA_B_TX_N: C22.1 J5.3(A-_Tx)
SATA_B_TX_P: C21.1 J5.2(A+_Tx)
SATA_C_RX_N: C28.1 J6.6(B+_Rx)
SATA_C_RX_P: C27.1 J6.5(B-_Rx)
SATA_C_TX_N: C26.1 J6.3(A-_Tx)
SATA_C_TX_P: C25.1 J6.2(A+_Tx)
NetSW1_5: U1.22(*OE) U2.22(*OE) U3.22(*OE) U4.22(*OE) U5.22(*OE) U6.22(*OE) U7.22(*OE) U8.22(*OE) ; port DISABLE_BUS

### Layout directives
differential pair: SATA_A_RX_N, SATA_A_RX_P, SATA_A_TX_N, SATA_A_TX_P, SATA_B_RX_N, SATA_B_RX_P, SATA_B_TX_N, SATA_B_TX_P, SATA_C_RX_N, SATA_C_RX_P, SATA_C_TX_N, SATA_C_TX_P

### Notes on the sheet
- FPGA 3.3V Inputs (TTL & PVDDSPI33)
- (near U1) TO FPGA
- FPGA 3.3V Outputs (PVDDSPI33)
- (near U2) TO CARD
- (near U3) TO CARD
- (near U4) TO CARD
- (near U5) FPGA 3.3V Outputs (TTL)
- (near U6) FPGA 3.3V Outputs (TTL)
- (near U7) FPGA 3.3V Outputs (TTL)
- (near U5) TO CARD
- (near U6) TO CARD
- (near U7) TO CARD
- (near U8) FPGA 3.3V Outputs (TTL)
- (near U8) TO CARD
- Bypass caps for level shifter rails: SRF @ 40 MHz
- All SATA MGTs wired as hosts, requiring CROSSOVER SATA cables.

### Library data of the parts
C1-C28 = Cap_0402: 0402 SMT Capacitor; Supplier 1: Mouser
  C1-C16: Supplier Part Number 1: 81-GRM155R71E473KA88
  C17-C28: Supplier Part Number 1: 81-GRM155R71C104KA88
J4-J6 = SATA-SMT-Jack: Molex SMT SATA Jack, Shrouded, 67800-5003; Supplier 1: Mouser
U1-U8 = SN74AVC8T245_RHL: 8-Bit Dual-Supply Bus Transceiver QFN 320 Mbps; Manufacturer: Texas Instruments; Manufacturer_Part_Number: sn74avc8t245_rhl_24; FAMILY_NAME: DIRECTION CONTROL DUAL SUPPLY TRANSLATOR; PIN_COUNT: 24; PACKAGE_DESIGNATOR: RHL; Datasheet URL: http://www.ti.com/lit/gpn/SN74AVC8T245; INDUSTRY_STD_PKG_TYPE: QFN; Vendor: Texas Instruments; RefDes: RefDes; Type: DEV; Value: Value; Supplier 1: Digi-Key; Supplier Part Number 1: 296-17859-1-ND

## Sheet WAB_1x4_HSMC_slots.SchDoc
size A2
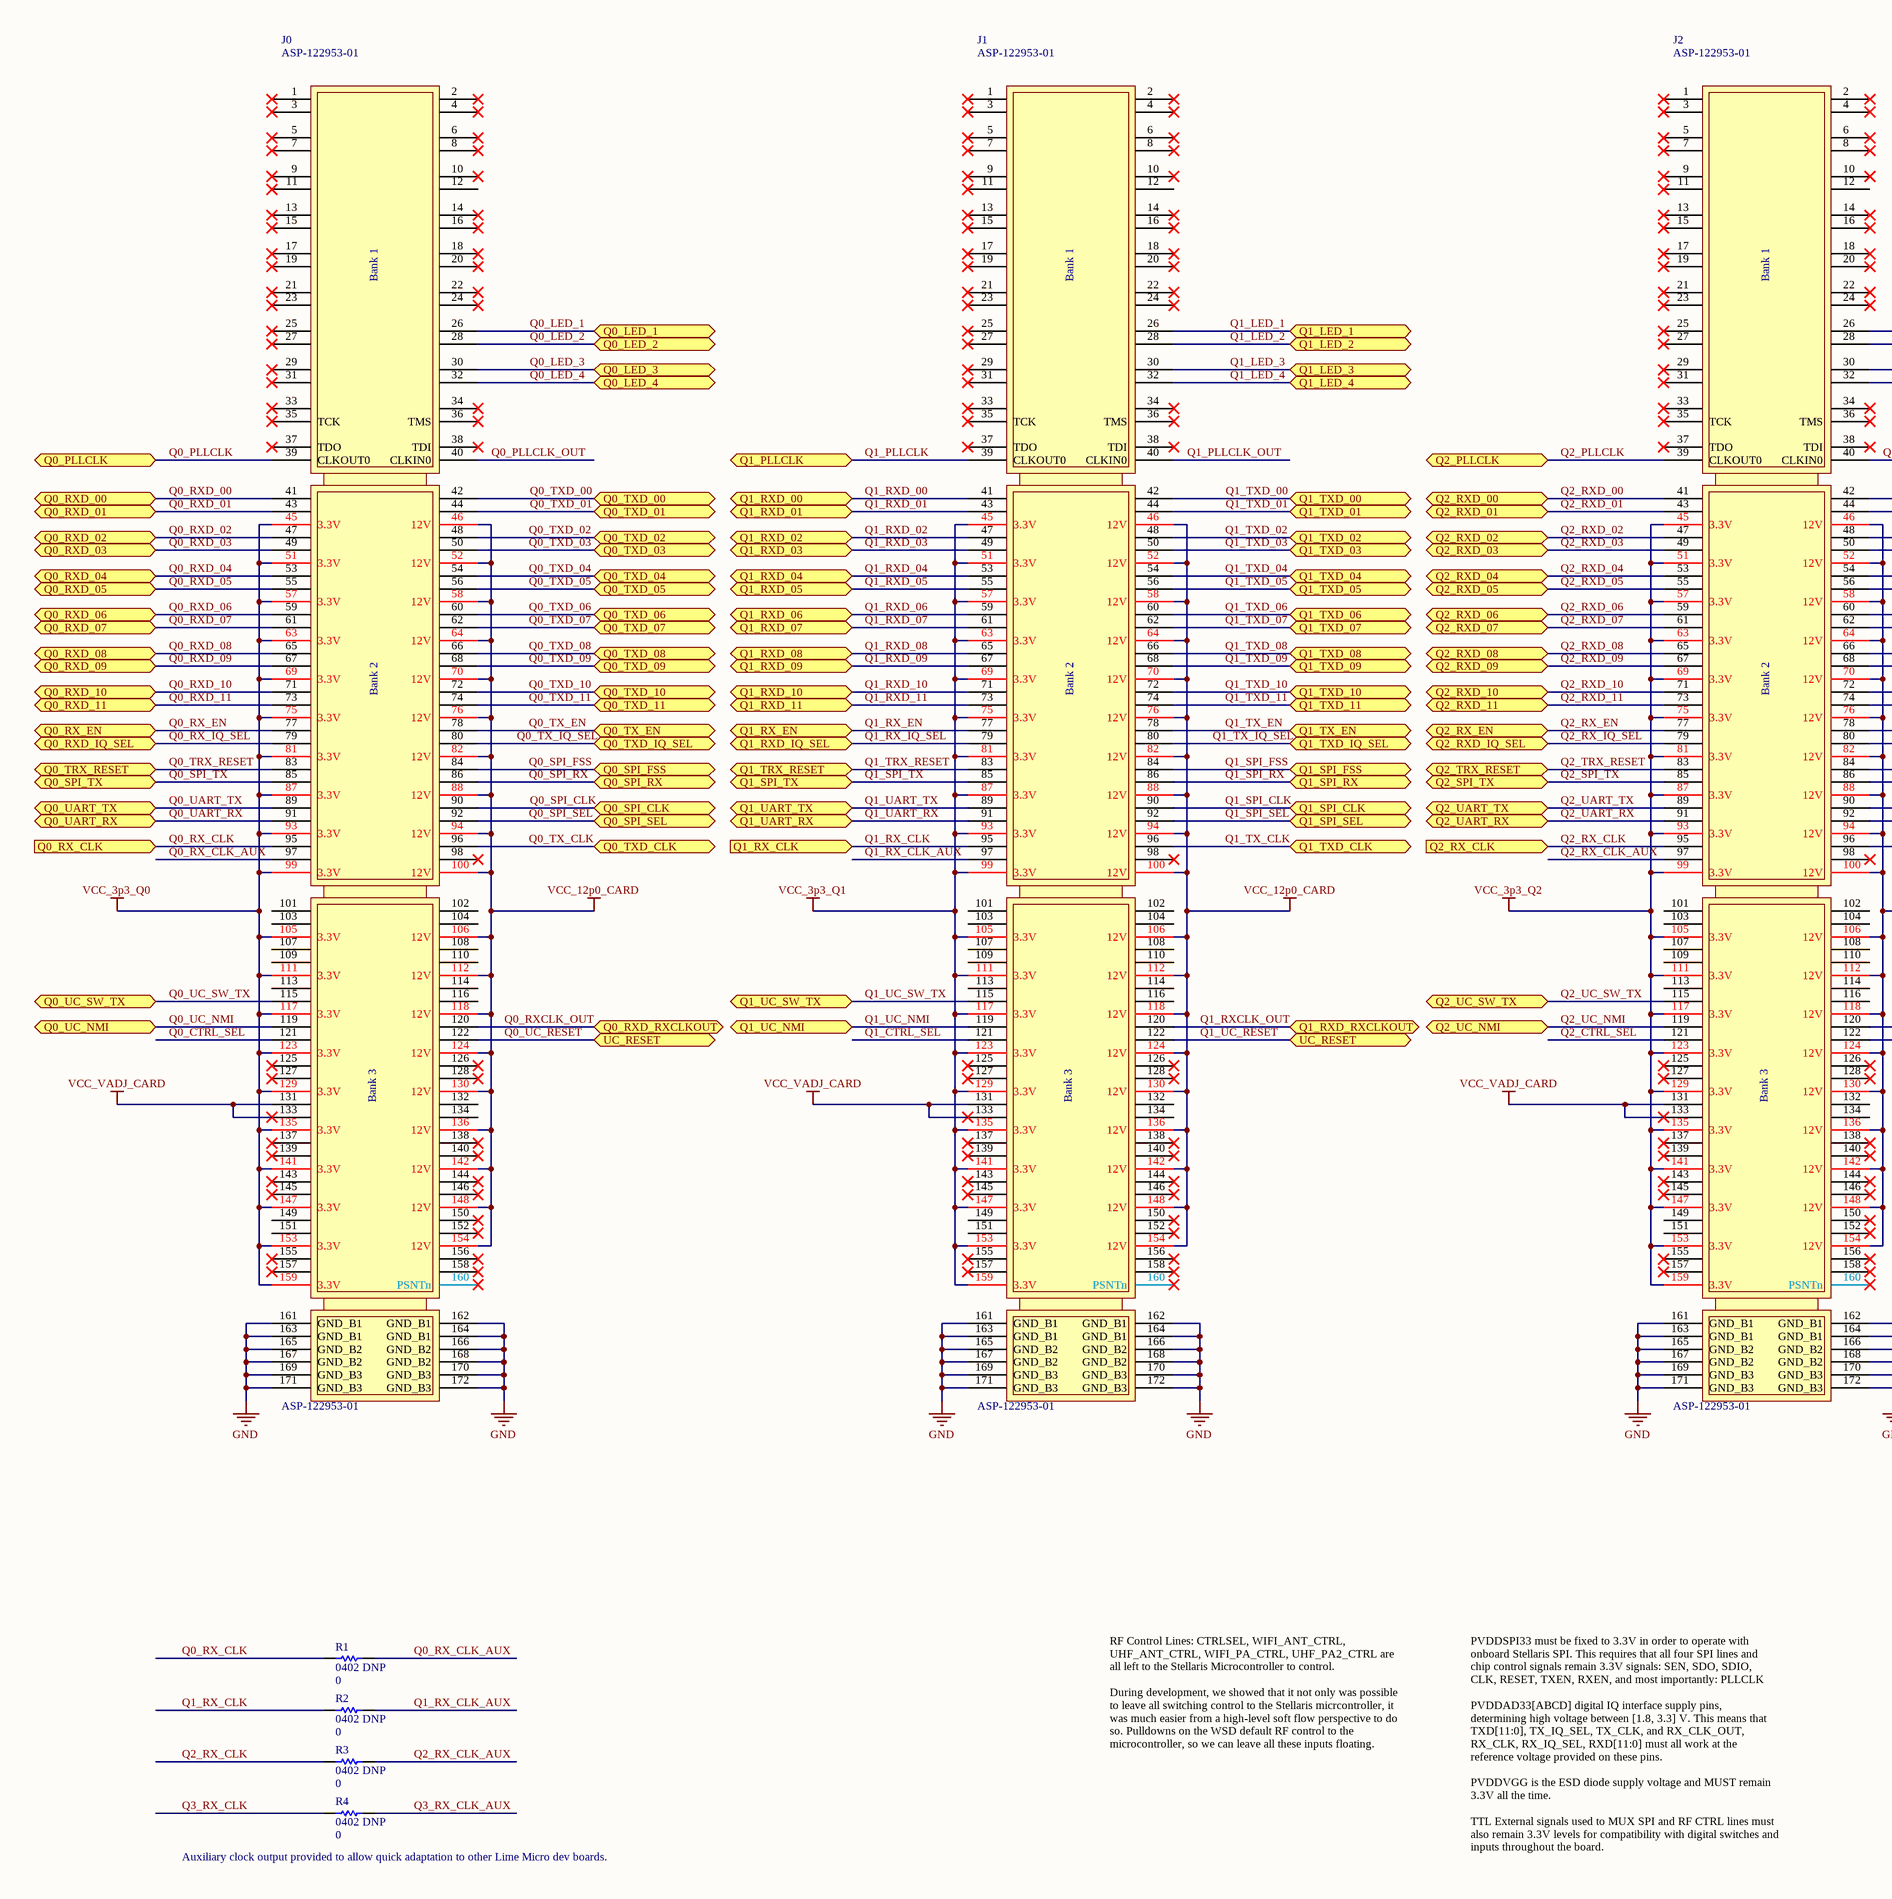
[diagram p2: WAB_1x4_HSMC_slots.SchDoc, left]
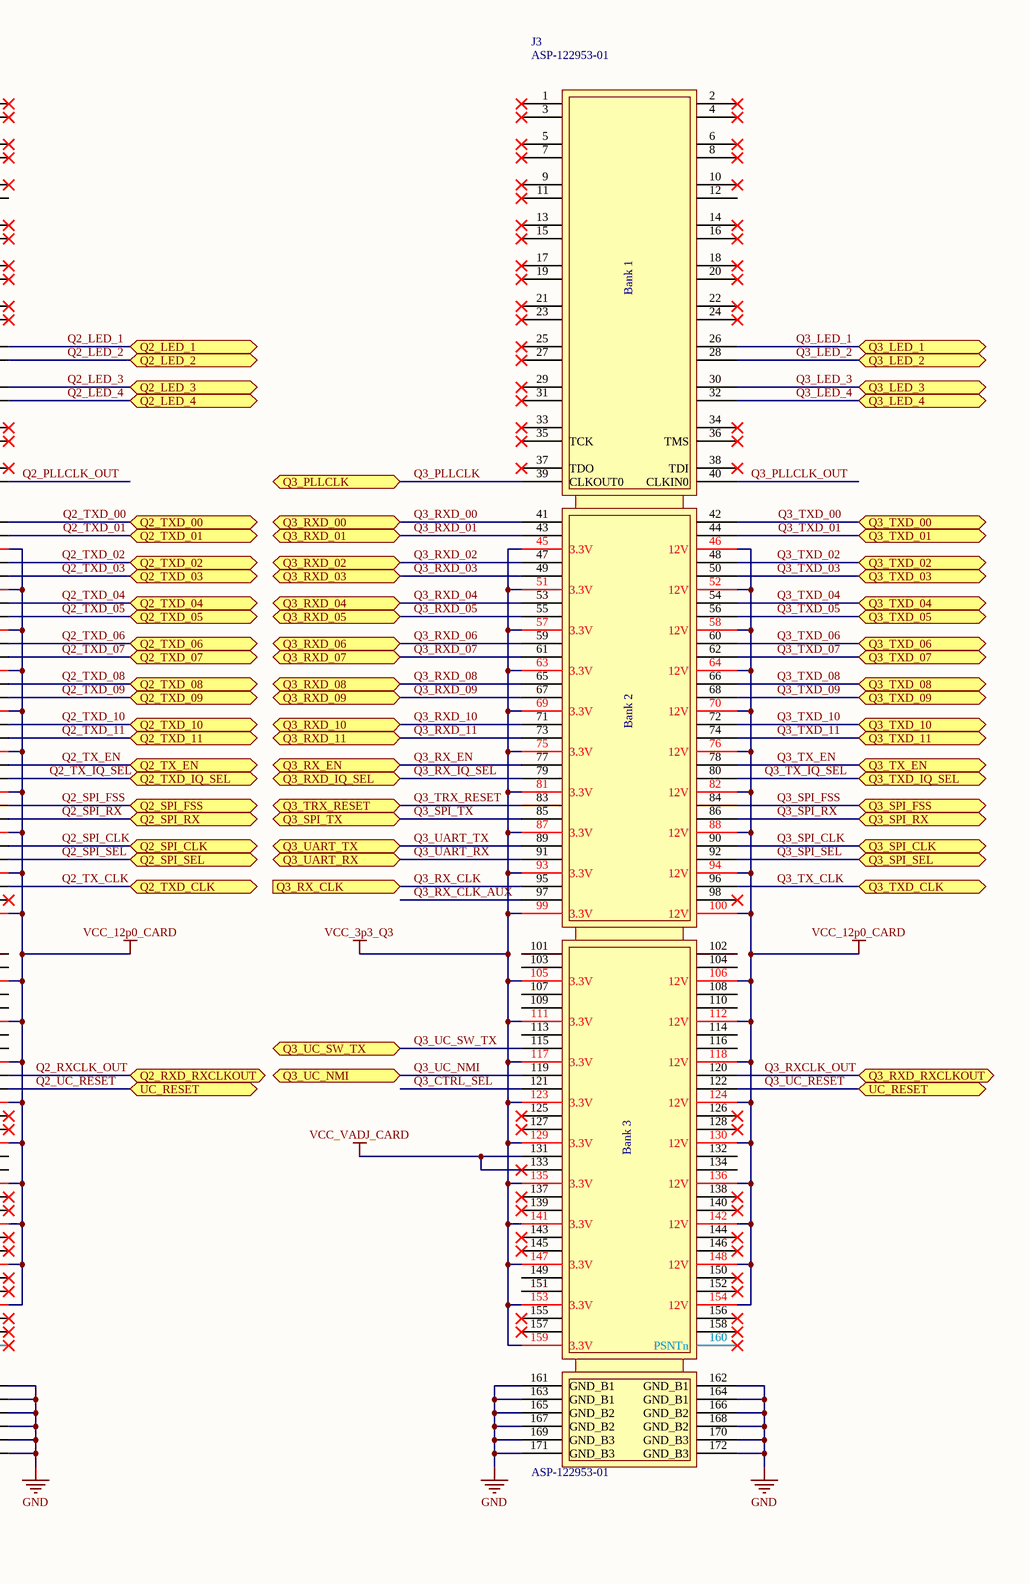
[diagram p3: WAB_1x4_HSMC_slots.SchDoc, right]

### Parts
J0  ASP-122953-01  [ASP-122953-01_v3]
J1  ASP-122953-01  [ASP-122953-01_v3]
J2  ASP-122953-01  [ASP-122953-01_v3]
J3  ASP-122953-01  [ASP-122953-01_v3]
R1  0402 DNP  value 0  [0402_SMT_RES]
R2  0402 DNP  value 0  [0402_SMT_RES]
R3  0402 DNP  value 0  [0402_SMT_RES]
R4  0402 DNP  value 0  [0402_SMT_RES]

### Ports
Q0_LED_1 (bidir), Q0_LED_2 (bidir), Q0_LED_3 (bidir), Q0_LED_4 (bidir), Q0_PLLCLK (bidir), Q0_RX_CLK (in), Q0_RX_EN (bidir), Q0_RXD_00 (bidir), Q0_RXD_01 (bidir), Q0_RXD_02 (bidir), Q0_RXD_03 (bidir), Q0_RXD_04 (bidir), Q0_RXD_05 (bidir), Q0_RXD_06 (bidir), Q0_RXD_07 (bidir), Q0_RXD_08 (bidir), Q0_RXD_09 (bidir), Q0_RXD_10 (bidir), Q0_RXD_11 (bidir), Q0_RXD_IQ_SEL (bidir), Q0_RXD_RXCLKOUT (bidir), Q0_SPI_CLK (bidir), Q0_SPI_FSS (bidir), Q0_SPI_RX (bidir), Q0_SPI_SEL (bidir), Q0_SPI_TX (bidir), Q0_TRX_RESET (bidir), Q0_TX_EN (bidir), Q0_TXD_00 (bidir), Q0_TXD_01 (bidir), Q0_TXD_02 (bidir), Q0_TXD_03 (bidir), Q0_TXD_04 (bidir), Q0_TXD_05 (bidir), Q0_TXD_06 (bidir), Q0_TXD_07 (bidir), Q0_TXD_08 (bidir), Q0_TXD_09 (bidir), Q0_TXD_10 (bidir), Q0_TXD_11 (bidir), Q0_TXD_CLK (bidir), Q0_TXD_IQ_SEL (bidir), Q0_UART_RX (bidir), Q0_UART_TX (bidir), Q0_UC_NMI (bidir), Q0_UC_SW_TX (bidir), Q1_LED_1 (bidir), Q1_LED_2 (bidir), Q1_LED_3 (bidir), Q1_LED_4 (bidir), Q1_PLLCLK (bidir), Q1_RX_CLK (in), Q1_RX_EN (bidir), Q1_RXD_00 (bidir), Q1_RXD_01 (bidir), Q1_RXD_02 (bidir), Q1_RXD_03 (bidir), Q1_RXD_04 (bidir), Q1_RXD_05 (bidir), Q1_RXD_06 (bidir), Q1_RXD_07 (bidir), Q1_RXD_08 (bidir), Q1_RXD_09 (bidir), Q1_RXD_10 (bidir), Q1_RXD_11 (bidir), Q1_RXD_IQ_SEL (bidir), Q1_RXD_RXCLKOUT (bidir), Q1_SPI_CLK (bidir), Q1_SPI_FSS (bidir), Q1_SPI_RX (bidir), Q1_SPI_SEL (bidir), Q1_SPI_TX (bidir), Q1_TRX_RESET (bidir), Q1_TX_EN (bidir), Q1_TXD_00 (bidir), Q1_TXD_01 (bidir), Q1_TXD_02 (bidir), Q1_TXD_03 (bidir), Q1_TXD_04 (bidir), Q1_TXD_05 (bidir), Q1_TXD_06 (bidir), Q1_TXD_07 (bidir), Q1_TXD_08 (bidir), Q1_TXD_09 (bidir), Q1_TXD_10 (bidir), Q1_TXD_11 (bidir), Q1_TXD_CLK (bidir), Q1_TXD_IQ_SEL (bidir), Q1_UART_RX (bidir), Q1_UART_TX (bidir), Q1_UC_NMI (bidir), Q1_UC_SW_TX (bidir), Q2_LED_1 (bidir), Q2_LED_2 (bidir), Q2_LED_3 (bidir), Q2_LED_4 (bidir), Q2_PLLCLK (bidir), Q2_RX_CLK (in), Q2_RX_EN (bidir), Q2_RXD_00 (bidir), Q2_RXD_01 (bidir), Q2_RXD_02 (bidir), Q2_RXD_03 (bidir), Q2_RXD_04 (bidir), Q2_RXD_05 (bidir), Q2_RXD_06 (bidir), Q2_RXD_07 (bidir), Q2_RXD_08 (bidir), Q2_RXD_09 (bidir), Q2_RXD_10 (bidir), Q2_RXD_11 (bidir), Q2_RXD_IQ_SEL (bidir), Q2_RXD_RXCLKOUT (bidir), Q2_SPI_CLK (bidir), Q2_SPI_FSS (bidir), Q2_SPI_RX (bidir), Q2_SPI_SEL (bidir), Q2_SPI_TX (bidir), Q2_TRX_RESET (bidir), Q2_TX_EN (bidir), Q2_TXD_00 (bidir), Q2_TXD_01 (bidir), Q2_TXD_02 (bidir), Q2_TXD_03 (bidir), Q2_TXD_04 (bidir), Q2_TXD_05 (bidir), Q2_TXD_06 (bidir), Q2_TXD_07 (bidir), Q2_TXD_08 (bidir), Q2_TXD_09 (bidir), Q2_TXD_10 (bidir), Q2_TXD_11 (bidir), Q2_TXD_CLK (bidir), Q2_TXD_IQ_SEL (bidir), Q2_UART_RX (bidir), Q2_UART_TX (bidir), Q2_UC_NMI (bidir), Q2_UC_SW_TX (bidir), Q3_LED_1 (bidir), Q3_LED_2 (bidir), Q3_LED_3 (bidir), Q3_LED_4 (bidir), Q3_PLLCLK (bidir), Q3_RX_CLK (in), Q3_RX_EN (bidir), Q3_RXD_00 (bidir), Q3_RXD_01 (bidir), Q3_RXD_02 (bidir), Q3_RXD_03 (bidir), Q3_RXD_04 (bidir), Q3_RXD_05 (bidir), Q3_RXD_06 (bidir), Q3_RXD_07 (bidir), Q3_RXD_08 (bidir), Q3_RXD_09 (bidir), Q3_RXD_10 (bidir), Q3_RXD_11 (bidir), Q3_RXD_IQ_SEL (bidir), Q3_RXD_RXCLKOUT (bidir), Q3_SPI_CLK (bidir), Q3_SPI_FSS (bidir), Q3_SPI_RX (bidir), Q3_SPI_SEL (bidir), Q3_SPI_TX (bidir), Q3_TRX_RESET (bidir), Q3_TX_EN (bidir), Q3_TXD_00 (bidir), Q3_TXD_01 (bidir), Q3_TXD_02 (bidir), Q3_TXD_03 (bidir), Q3_TXD_04 (bidir), Q3_TXD_05 (bidir), Q3_TXD_06 (bidir), Q3_TXD_07 (bidir), Q3_TXD_08 (bidir), Q3_TXD_09 (bidir), Q3_TXD_10 (bidir), Q3_TXD_11 (bidir), Q3_TXD_CLK (bidir), Q3_TXD_IQ_SEL (bidir), Q3_UART_RX (bidir), Q3_UART_TX (bidir), Q3_UC_NMI (bidir), Q3_UC_SW_TX (bidir), UC_RESET (bidir)

### Nets
GND: J0.161(GND_B1) J0.162(GND_B1) J0.163(GND_B1) J0.164(GND_B1) J0.165(GND_B2) J0.166(GND_B2) J0.167(GND_B2) J0.168(GND_B2) J0.169(GND_B3) J0.170(GND_B3) J0.171(GND_B3) J0.172(GND_B3) J1.161(GND_B1) J1.162(GND_B1) J1.163(GND_B1) J1.164(GND_B1) J1.165(GND_B2) J1.166(GND_B2) J1.167(GND_B2) J1.168(GND_B2) J1.169(GND_B3) J1.170(GND_B3) J1.171(GND_B3) J1.172(GND_B3) J2.161(GND_B1) J2.162(GND_B1) J2.163(GND_B1) J2.164(GND_B1) J2.165(GND_B2) J2.166(GND_B2) J2.167(GND_B2) J2.168(GND_B2) J2.169(GND_B3) J2.170(GND_B3) J2.171(GND_B3) J2.172(GND_B3) J3.161(GND_B1) J3.162(GND_B1) J3.163(GND_B1) J3.164(GND_B1) J3.165(GND_B2) J3.166(GND_B2) J3.167(GND_B2) J3.168(GND_B2) J3.169(GND_B3) J3.170(GND_B3) J3.171(GND_B3) J3.172(GND_B3)
VCC_3p3_Q0: J0.45(3.3V) J0.51(3.3V) J0.57(3.3V) J0.63(3.3V) J0.69(3.3V) J0.75(3.3V) J0.81(3.3V) J0.87(3.3V) J0.93(3.3V) J0.99(3.3V) J0.105(3.3V) J0.111(3.3V) J0.117(3.3V) J0.123(3.3V) J0.129(3.3V) J0.135(3.3V) J0.141(3.3V) J0.147(3.3V) J0.153(3.3V) J0.159(3.3V)
VCC_3p3_Q1: J1.45(3.3V) J1.51(3.3V) J1.57(3.3V) J1.63(3.3V) J1.69(3.3V) J1.75(3.3V) J1.81(3.3V) J1.87(3.3V) J1.93(3.3V) J1.99(3.3V) J1.105(3.3V) J1.111(3.3V) J1.117(3.3V) J1.123(3.3V) J1.129(3.3V) J1.135(3.3V) J1.141(3.3V) J1.147(3.3V) J1.153(3.3V) J1.159(3.3V)
VCC_3p3_Q2: J2.45(3.3V) J2.51(3.3V) J2.57(3.3V) J2.63(3.3V) J2.69(3.3V) J2.75(3.3V) J2.81(3.3V) J2.87(3.3V) J2.93(3.3V) J2.99(3.3V) J2.105(3.3V) J2.111(3.3V) J2.117(3.3V) J2.123(3.3V) J2.129(3.3V) J2.135(3.3V) J2.141(3.3V) J2.147(3.3V) J2.153(3.3V) J2.159(3.3V)
VCC_3p3_Q3: J3.45(3.3V) J3.51(3.3V) J3.57(3.3V) J3.63(3.3V) J3.69(3.3V) J3.75(3.3V) J3.81(3.3V) J3.87(3.3V) J3.93(3.3V) J3.99(3.3V) J3.105(3.3V) J3.111(3.3V) J3.117(3.3V) J3.123(3.3V) J3.129(3.3V) J3.135(3.3V) J3.141(3.3V) J3.147(3.3V) J3.153(3.3V) J3.159(3.3V)
VCC_12p0_CARD: J0.46(12V) J0.52(12V) J0.58(12V) J0.64(12V) J0.70(12V) J0.76(12V) J0.82(12V) J0.88(12V) J0.94(12V) J0.100(12V) J0.106(12V) J0.112(12V) J0.118(12V) J0.124(12V) J0.130(12V) J0.136(12V) J0.142(12V) J0.148(12V) J0.154(12V) J1.46(12V) J1.52(12V) J1.58(12V) J1.64(12V) J1.70(12V) J1.76(12V) J1.82(12V) J1.88(12V) J1.94(12V) J1.100(12V) J1.106(12V) J1.112(12V) J1.118(12V) J1.124(12V) J1.130(12V) J1.136(12V) J1.142(12V) J1.148(12V) J1.154(12V) J2.46(12V) J2.52(12V) J2.58(12V) J2.64(12V) J2.70(12V) J2.76(12V) J2.82(12V) J2.88(12V) J2.94(12V) J2.100(12V) J2.106(12V) J2.112(12V) J2.118(12V) J2.124(12V) J2.130(12V) J2.136(12V) J2.142(12V) J2.148(12V) J2.154(12V) J3.46(12V) J3.52(12V) J3.58(12V) J3.64(12V) J3.70(12V) J3.76(12V) J3.82(12V) J3.88(12V) J3.94(12V) J3.100(12V) J3.106(12V) J3.112(12V) J3.118(12V) J3.124(12V) J3.130(12V) J3.136(12V) J3.142(12V) J3.148(12V) J3.154(12V)
VCC_VADJ_CARD: J0.131 J0.133 J1.131 J1.133 J2.131 J2.133 J3.131 J3.133  [project net VADJ]
Q0_CTRL_SEL: J0.121
Q0_LED_1: J0.26 ; port Q0_LED_1
Q0_LED_2: J0.28 ; port Q0_LED_2
Q0_LED_3: J0.30 ; port Q0_LED_3
Q0_LED_4: J0.32 ; port Q0_LED_4
Q0_PLLCLK: J0.39(CLKOUT0) ; port Q0_PLLCLK
Q0_PLLCLK_OUT: J0.40(CLKIN0)
Q0_RX_CLK: J0.95 R1.1 ; port Q0_RX_CLK
Q0_RX_CLK_AUX: J0.97 R1.2
Q0_RX_EN: J0.77 ; port Q0_RX_EN
Q0_RX_IQ_SEL: J0.79 ; port Q0_RXD_IQ_SEL  [project net HA18_N]
Q0_RXCLK_OUT: J0.120 ; port Q0_RXD_RXCLKOUT  [project net HA00_CC_P]
Q0_RXD_00: J0.41 ; port Q0_RXD_00  [project net HA13_P]
Q0_RXD_01: J0.43 ; port Q0_RXD_01  [project net HA11_P]
Q0_RXD_02: J0.47 ; port Q0_RXD_02  [project net HA13_N]
Q0_RXD_03: J0.49 ; port Q0_RXD_03  [project net HA11_N]
Q0_RXD_04: J0.53 ; port Q0_RXD_04  [project net HA10_N]
Q0_RXD_05: J0.55 ; port Q0_RXD_05  [project net HA10_P]
Q0_RXD_06: J0.59 ; port Q0_RXD_06  [project net HA16_P]
Q0_RXD_07: J0.61 ; port Q0_RXD_07  [project net HA06_N]
Q0_RXD_08: J0.65 ; port Q0_RXD_08  [project net HA16_N]
Q0_RXD_09: J0.67 ; port Q0_RXD_09  [project net HA06_P]
Q0_RXD_10: J0.71 ; port Q0_RXD_10  [project net HA18_P]
Q0_RXD_11: J0.73 ; port Q0_RXD_11  [project net HA02_N]
Q0_SPI_CLK: J0.90 ; port Q0_SPI_CLK
Q0_SPI_FSS: J0.84 ; port Q0_SPI_FSS
Q0_SPI_RX: J0.86 ; port Q0_SPI_RX
Q0_SPI_SEL: J0.92 ; port Q0_SPI_SEL
Q0_SPI_TX: J0.85 ; port Q0_SPI_TX
Q0_TRX_RESET: J0.83 ; port Q0_TRX_RESET
Q0_TX_CLK: J0.96 ; port Q0_TXD_CLK  [project net HA01_CC_P]
Q0_TX_EN: J0.78 ; port Q0_TX_EN
Q0_TX_IQ_SEL: J0.80 ; port Q0_TXD_IQ_SEL  [project net HA08_N]
Q0_TXD_00: J0.42 ; port Q0_TXD_00  [project net HA03_P]
Q0_TXD_01: J0.44 ; port Q0_TXD_01  [project net HA05_P]
Q0_TXD_02: J0.48 ; port Q0_TXD_02  [project net HA04_P]
Q0_TXD_03: J0.50 ; port Q0_TXD_03  [project net HA05_N]
Q0_TXD_04: J0.54 ; port Q0_TXD_04  [project net HA03_N]
Q0_TXD_05: J0.56 ; port Q0_TXD_05  [project net HA02_P]
Q0_TXD_06: J0.60 ; port Q0_TXD_06  [project net HA04_N]
Q0_TXD_07: J0.62 ; port Q0_TXD_07  [project net HA09_P]
Q0_TXD_08: J0.66 ; port Q0_TXD_08  [project net HA07_P]
Q0_TXD_09: J0.68 ; port Q0_TXD_09  [project net HA07_N]
Q0_TXD_10: J0.72 ; port Q0_TXD_10  [project net HA09_N]
Q0_TXD_11: J0.74 ; port Q0_TXD_11  [project net HA08_P]
Q0_UART_RX: J0.91 ; port Q0_UART_RX
Q0_UART_TX: J0.89 ; port Q0_UART_TX
Q0_UC_NMI: J0.119 ; port Q0_UC_NMI
Q0_UC_RESET: J0.122 J1.122 J2.122 J3.122 ; port UC_RESET  [also labelled Q1_UC_RESET, Q2_UC_RESET, Q3_UC_RESET]  [project net ~{uC_RESET}]
Q0_UC_SW_TX: J0.115 ; port Q0_UC_SW_TX
Q1_CTRL_SEL: J1.121
Q1_LED_1: J1.26 ; port Q1_LED_1
Q1_LED_2: J1.28 ; port Q1_LED_2
Q1_LED_3: J1.30 ; port Q1_LED_3
Q1_LED_4: J1.32 ; port Q1_LED_4
Q1_PLLCLK: J1.39(CLKOUT0) ; port Q1_PLLCLK
Q1_PLLCLK_OUT: J1.40(CLKIN0)
Q1_RX_CLK: J1.95 R2.1 ; port Q1_RX_CLK
Q1_RX_CLK_AUX: J1.97 R2.2
Q1_RX_EN: J1.77 ; port Q1_RX_EN
Q1_RX_IQ_SEL: J1.79 ; port Q1_RXD_IQ_SEL  [project net HB14_N]
Q1_RXCLK_OUT: J1.120 ; port Q1_RXD_RXCLKOUT  [project net HB00_CC_P]
Q1_RXD_00: J1.41 ; port Q1_RXD_00  [project net HB08_N]
Q1_RXD_01: J1.43 ; port Q1_RXD_01  [project net HB11_P]
Q1_RXD_02: J1.47 ; port Q1_RXD_02  [project net HB13_P]
Q1_RXD_03: J1.49 ; port Q1_RXD_03  [project net HB12_P]
Q1_RXD_04: J1.53 ; port Q1_RXD_04  [project net HB13_N]
Q1_RXD_05: J1.55 ; port Q1_RXD_05  [project net HB11_N]
Q1_RXD_06: J1.59 ; port Q1_RXD_06  [project net HB10_P]
Q1_RXD_07: J1.61 ; port Q1_RXD_07  [project net HB12_N]
Q1_RXD_08: J1.65 ; port Q1_RXD_08  [project net HB10_N]
Q1_RXD_09: J1.67 ; port Q1_RXD_09  [project net HB15_P]
Q1_RXD_10: J1.71 ; port Q1_RXD_10  [project net HB15_N]
Q1_RXD_11: J1.73 ; port Q1_RXD_11  [project net HB14_P]
Q1_SPI_CLK: J1.90 ; port Q1_SPI_CLK
Q1_SPI_FSS: J1.84 ; port Q1_SPI_FSS
Q1_SPI_RX: J1.86 ; port Q1_SPI_RX
Q1_SPI_SEL: J1.92 ; port Q1_SPI_SEL
Q1_SPI_TX: J1.85 ; port Q1_SPI_TX
Q1_TRX_RESET: J1.83 ; port Q1_TRX_RESET
Q1_TX_CLK: J1.96 ; port Q1_TXD_CLK  [project net HB06_CC_P]
Q1_TX_EN: J1.78 ; port Q1_TX_EN
Q1_TX_IQ_SEL: J1.80 ; port Q1_TXD_IQ_SEL  [project net HB08_P]
Q1_TXD_00: J1.42 ; port Q1_TXD_00  [project net HB03_P]
Q1_TXD_01: J1.44 ; port Q1_TXD_01  [project net HB03_N]
Q1_TXD_02: J1.48 ; port Q1_TXD_02  [project net HB02_P]
Q1_TXD_03: J1.50 ; port Q1_TXD_03  [project net HB02_N]
Q1_TXD_04: J1.54 ; port Q1_TXD_04  [project net HB01_P]
Q1_TXD_05: J1.56 ; port Q1_TXD_05  [project net HB01_N]
Q1_TXD_06: J1.60 ; port Q1_TXD_06  [project net HB04_P]
Q1_TXD_07: J1.62 ; port Q1_TXD_07  [project net HB04_N]
Q1_TXD_08: J1.66 ; port Q1_TXD_08  [project net HB07_P]
Q1_TXD_09: J1.68 ; port Q1_TXD_09  [project net HB09_P]
Q1_TXD_10: J1.72 ; port Q1_TXD_10  [project net HB07_N]
Q1_TXD_11: J1.74 ; port Q1_TXD_11  [project net HB09_N]
Q1_UART_RX: J1.91 ; port Q1_UART_RX
Q1_UART_TX: J1.89 ; port Q1_UART_TX
Q1_UC_NMI: J1.119 ; port Q1_UC_NMI
Q1_UC_SW_TX: J1.115 ; port Q1_UC_SW_TX
Q2_CTRL_SEL: J2.121
Q2_LED_1: J2.26 ; port Q2_LED_1
Q2_LED_2: J2.28 ; port Q2_LED_2
Q2_LED_3: J2.30 ; port Q2_LED_3
Q2_LED_4: J2.32 ; port Q2_LED_4
Q2_PLLCLK: J2.39(CLKOUT0) ; port Q2_PLLCLK
Q2_PLLCLK_OUT: J2.40(CLKIN0)
Q2_RX_CLK: J2.95 R3.1 ; port Q2_RX_CLK
Q2_RX_CLK_AUX: J2.97 R3.2
Q2_RX_EN: J2.77 ; port Q2_RX_EN
Q2_RX_IQ_SEL: J2.79 ; port Q2_RXD_IQ_SEL  [project net HA14_N]
Q2_RXCLK_OUT: J2.120 ; port Q2_RXD_RXCLKOUT  [project net LA00_CC_P]
Q2_RXD_00: J2.41 ; port Q2_RXD_00  [project net LA08_N]
Q2_RXD_01: J2.43 ; port Q2_RXD_01  [project net LA10_P]
Q2_RXD_02: J2.47 ; port Q2_RXD_02  [project net HA12_N]
Q2_RXD_03: J2.49 ; port Q2_RXD_03  [project net LA10_N]
Q2_RXD_04: J2.53 ; port Q2_RXD_04  [project net LA12_P]
Q2_RXD_05: J2.55 ; port Q2_RXD_05  [project net HA15_P]
Q2_RXD_06: J2.59 ; port Q2_RXD_06  [project net LA12_N]
Q2_RXD_07: J2.61 ; port Q2_RXD_07  [project net LA13_P]
Q2_RXD_08: J2.65 ; port Q2_RXD_08  [project net HA15_N]
Q2_RXD_09: J2.67 ; port Q2_RXD_09  [project net LA13_N]
Q2_RXD_10: J2.71 ; port Q2_RXD_10  [project net LA11_P]
Q2_RXD_11: J2.73 ; port Q2_RXD_11  [project net LA11_N]
Q2_SPI_CLK: J2.90 ; port Q2_SPI_CLK
Q2_SPI_FSS: J2.84 ; port Q2_SPI_FSS
Q2_SPI_RX: J2.86 ; port Q2_SPI_RX
Q2_SPI_SEL: J2.92 ; port Q2_SPI_SEL
Q2_SPI_TX: J2.85 ; port Q2_SPI_TX
Q2_TRX_RESET: J2.83 ; port Q2_TRX_RESET
Q2_TX_CLK: J2.96 ; port Q2_TXD_CLK  [project net LA01_CC_P]
Q2_TX_EN: J2.78 ; port Q2_TX_EN
Q2_TX_IQ_SEL: J2.80 ; port Q2_TXD_IQ_SEL  [project net HA12_P]
Q2_TXD_00: J2.42 ; port Q2_TXD_00  [project net HA14_P]
Q2_TXD_01: J2.44 ; port Q2_TXD_01  [project net LA02_P]
Q2_TXD_02: J2.48 ; port Q2_TXD_02  [project net LA02_N]
Q2_TXD_03: J2.50 ; port Q2_TXD_03  [project net LA03_P]
Q2_TXD_04: J2.54 ; port Q2_TXD_04  [project net LA04_P]
Q2_TXD_05: J2.56 ; port Q2_TXD_05  [project net LA06_P]
Q2_TXD_06: J2.60 ; port Q2_TXD_06  [project net LA03_N]
Q2_TXD_07: J2.62 ; port Q2_TXD_07  [project net LA04_N]
Q2_TXD_08: J2.66 ; port Q2_TXD_08  [project net LA06_N]
Q2_TXD_09: J2.68 ; port Q2_TXD_09  [project net LA05_P]
Q2_TXD_10: J2.72 ; port Q2_TXD_10  [project net LA05_N]
Q2_TXD_11: J2.74 ; port Q2_TXD_11  [project net LA08_P]
Q2_UART_RX: J2.91 ; port Q2_UART_RX
Q2_UART_TX: J2.89 ; port Q2_UART_TX
Q2_UC_NMI: J2.119 ; port Q2_UC_NMI
Q2_UC_SW_TX: J2.115 ; port Q2_UC_SW_TX
Q3_CTRL_SEL: J3.121
Q3_LED_1: J3.26 ; port Q3_LED_1
Q3_LED_2: J3.28 ; port Q3_LED_2
Q3_LED_3: J3.30 ; port Q3_LED_3
Q3_LED_4: J3.32 ; port Q3_LED_4
Q3_PLLCLK: J3.39(CLKOUT0) ; port Q3_PLLCLK
Q3_PLLCLK_OUT: J3.40(CLKIN0)
Q3_RX_CLK: J3.95 R4.1 ; port Q3_RX_CLK
Q3_RX_CLK_AUX: J3.97 R4.2
Q3_RX_EN: J3.77 ; port Q3_RX_EN
Q3_RX_IQ_SEL: J3.79 ; port Q3_RXD_IQ_SEL  [project net LA21_P]
Q3_RXCLK_OUT: J3.120 ; port Q3_RXD_RXCLKOUT  [project net LA17_CC_P]
Q3_RXD_00: J3.41 ; port Q3_RXD_00  [project net LA16_P]
Q3_RXD_01: J3.43 ; port Q3_RXD_01  [project net LA16_N]
Q3_RXD_02: J3.47 ; port Q3_RXD_02  [project net LA15_P]
Q3_RXD_03: J3.49 ; port Q3_RXD_03  [project net LA15_N]
Q3_RXD_04: J3.53 ; port Q3_RXD_04  [project net LA20_P]
Q3_RXD_05: J3.55 ; port Q3_RXD_05  [project net LA20_N]
Q3_RXD_06: J3.59 ; port Q3_RXD_06  [project net LA19_P]
Q3_RXD_07: J3.61 ; port Q3_RXD_07  [project net LA23_P]
Q3_RXD_08: J3.65 ; port Q3_RXD_08  [project net LA19_N]
Q3_RXD_09: J3.67 ; port Q3_RXD_09  [project net LA23_N]
Q3_RXD_10: J3.71 ; port Q3_RXD_10  [project net LA22_P]
Q3_RXD_11: J3.73 ; port Q3_RXD_11  [project net LA22_N]
Q3_SPI_CLK: J3.90 ; port Q3_SPI_CLK
Q3_SPI_FSS: J3.84 ; port Q3_SPI_FSS
Q3_SPI_RX: J3.86 ; port Q3_SPI_RX
Q3_SPI_SEL: J3.92 ; port Q3_SPI_SEL
Q3_SPI_TX: J3.85 ; port Q3_SPI_TX
Q3_TRX_RESET: J3.83 ; port Q3_TRX_RESET
Q3_TX_CLK: J3.96 ; port Q3_TXD_CLK  [project net LA18_CC_P]
Q3_TX_EN: J3.78 ; port Q3_TX_EN
Q3_TX_IQ_SEL: J3.80 ; port Q3_TXD_IQ_SEL  [project net LA30_N]
Q3_TXD_00: J3.42 ; port Q3_TXD_00  [project net LA21_N]
Q3_TXD_01: J3.44 ; port Q3_TXD_01  [project net LA26_P]
Q3_TXD_02: J3.48 ; port Q3_TXD_02  [project net LA25_P]
Q3_TXD_03: J3.50 ; port Q3_TXD_03  [project net LA26_N]
Q3_TXD_04: J3.54 ; port Q3_TXD_04  [project net LA24_P]
Q3_TXD_05: J3.56 ; port Q3_TXD_05  [project net LA25_N]
Q3_TXD_06: J3.60 ; port Q3_TXD_06  [project net LA29_P]
Q3_TXD_07: J3.62 ; port Q3_TXD_07  [project net LA24_N]
Q3_TXD_08: J3.66 ; port Q3_TXD_08  [project net LA28_P]
Q3_TXD_09: J3.68 ; port Q3_TXD_09  [project net LA29_N]
Q3_TXD_10: J3.72 ; port Q3_TXD_10  [project net LA30_P]
Q3_TXD_11: J3.74 ; port Q3_TXD_11  [project net LA28_N]
Q3_UART_RX: J3.91 ; port Q3_UART_RX
Q3_UART_TX: J3.89 ; port Q3_UART_TX
Q3_UC_NMI: J3.119 ; port Q3_UC_NMI
Q3_UC_SW_TX: J3.115 ; port Q3_UC_SW_TX

Not connected (* = marked no-connect by the designer): J0 1* 2* 3* 4* 5* 6* 7* 8* 9* 10* 11* 12 13* 14* 15* 16* 17* 18* 19* 20* 21* 22* 23* 24* 25* 27* 29* 31* 33(SDA)* 34(SCL)* 35(TCK)* 36(TMS)* 37(TDO)* 38(TDI)* 98* 101 102 103 104 107 108 109 110 113 114 116 125* 126* 127* 128* 132 134 137* 138* 139* 140* 143* 144* 145* 146* 149 150* 151 152* 155* 156* 157* 158* 160(PSNTn)*; J1 1* 2* 3* 4* 5* 6* 7* 8* 9* 10* 11* 12 13* 14* 15* 16* 17* 18* 19* 20* 21* 22* 23* 24* 25* 27* 29* 31* 33(SDA)* 34(SCL)* 35(TCK)* 36(TMS)* 37(TDO)* 38(TDI)* 98* 101 102 103 104 107 108 109 110 113 114 116 125* 126* 127* 128* 132 134 137* 138* 139* 140* 143* 144* 145* 146* 149 150* 151 152* 155* 156* 157* 158* 160(PSNTn)*; J2 1* 2* 3* 4* 5* 6* 7* 8* 9* 10* 11* 12 13* 14* 15* 16* 17* 18* 19* 20* 21* 22* 23* 24* 25* 27* 29* 31* 33(SDA)* 34(SCL)* 35(TCK)* 36(TMS)* 37(TDO)* 38(TDI)* 98* 101 102 103 104 107 108 109 110 113 114 116 125* 126* 127* 128* 132 134 137* 138* 139* 140* 143* 144* 145* 146* 149 150* 151 152* 155* 156* 157* 158* 160(PSNTn)*; J3 1* 2* 3* 4* 5* 6* 7* 8* 9* 10* 11* 12 13* 14* 15* 16* 17* 18* 19* 20* 21* 22* 23* 24* 25* 27* 29* 31* 33(SDA)* 34(SCL)* 35(TCK)* 36(TMS)* 37(TDO)* 38(TDI)* 98* 101 102 103 104 107 108 109 110 113 114 116 125* 126* 127* 128* 132 134 137* 138* 139* 140* 143* 144* 145* 146* 149 150* 151 152* 155* 156* 157* 158* 160(PSNTn)*

### Notes on the sheet
- RF Control Lines: CTRLSEL, WIFI_ANT_CTRL, UHF_ANT_CTRL, WIFI_PA_CTRL, UHF_PA2_CTRL are all left to the Stellaris Microcontroller to control.
  During development, we showed that it not only was possible to leave all switching control to the Stellaris micrcontroller, it was much easier from a high-level soft flow perspective to do so. Pulldowns on the WSD default RF control to the microcontroller, so we can leave all these inputs floating.
- (near R4) Auxiliary clock output provided to allow quick adaptation to other Lime Micro dev boards.
- PVDDSPI33 must be fixed to 3.3V in order to operate with onboard Stellaris SPI. This requires that all four SPI lines and chip control signals remain 3.3V signals: SEN, SDO, SDIO, CLK, RESET, TXEN, RXEN, and most importantly: PLLCLK
  PVDDAD33[ABCD] digital IQ interface supply pins, determining high voltage between [1.8, 3.3] V. This means that TXD[11:0], TX_IQ_SEL, TX_CLK, and RX_CLK_OUT, RX_CLK, RX_IQ_SEL, RXD[11:0] must all work at the reference voltage provided on these pins.
  PVDDVGG is the ESD diode supply voltage and MUST remain 3.3V all the time.
  TTL External signals used to MUX SPI and RF CTRL lines must also remain 3.3V levels for compatibility with digital switches and inputs throughout the board.
- (in symbol ASP-122953-01) Bank 1; Bank 2; Bank 3

### Library data of the parts
J0-J3 = ASP-122953-01: Samtec HSMC Host Connector (Female)
R1-R4 = Res_0402: 0402 SMT Resistor; Supplier 1: Mouser; Supplier Part Number 1: 594-MCS04020Z0000ZE0